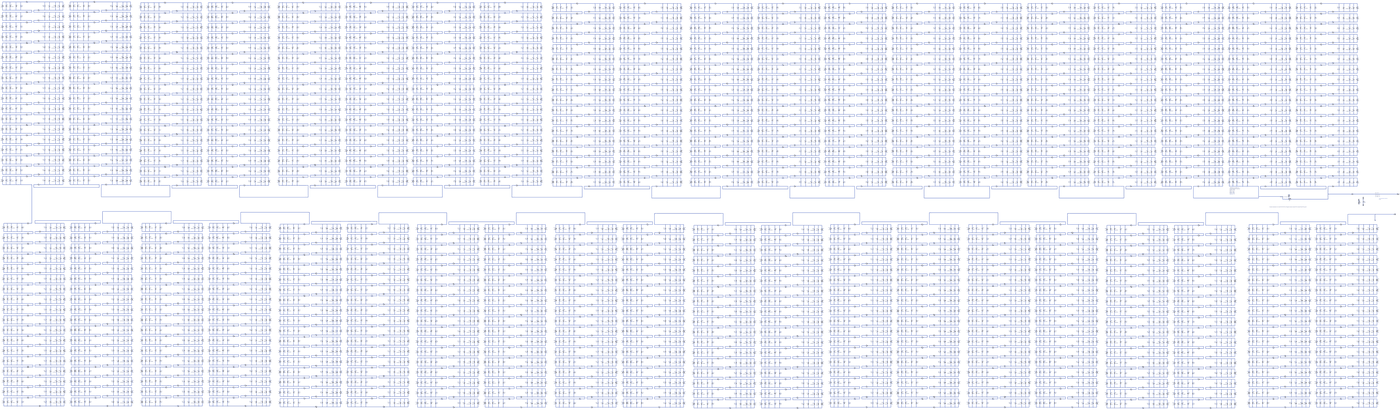
[diagram p0: schematic jac--m5sf-2--module-string--mosfet.asc, whole sheet]
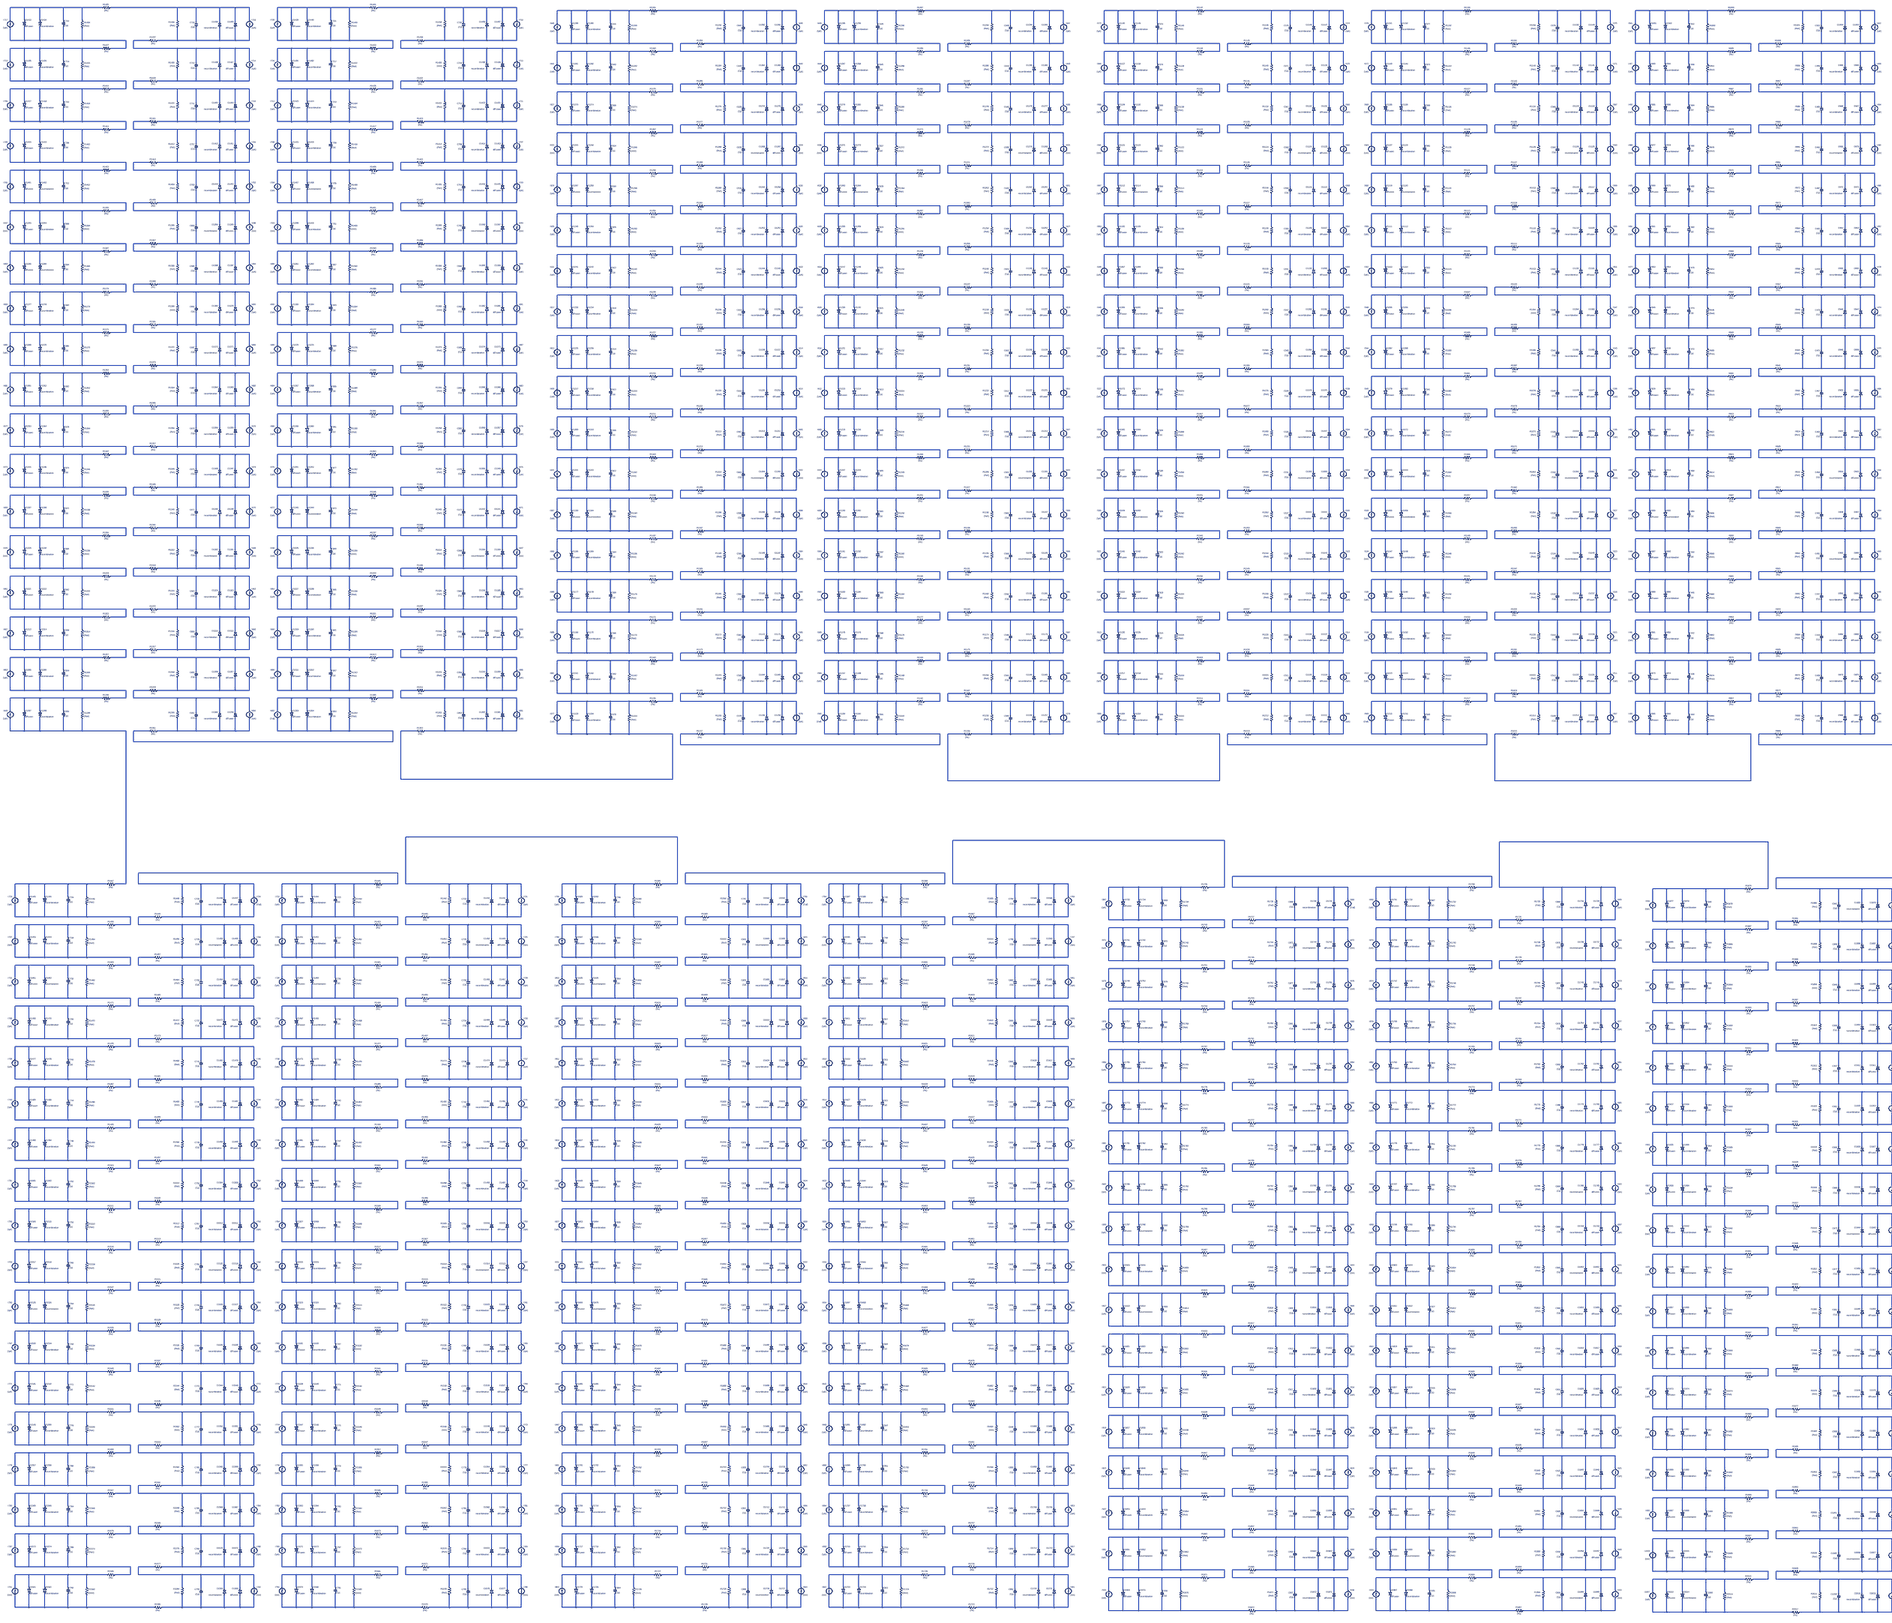
[diagram p1: schematic jac--m5sf-2--module-string--mosfet.asc, part, row 1 of 1, column 1 of 3]
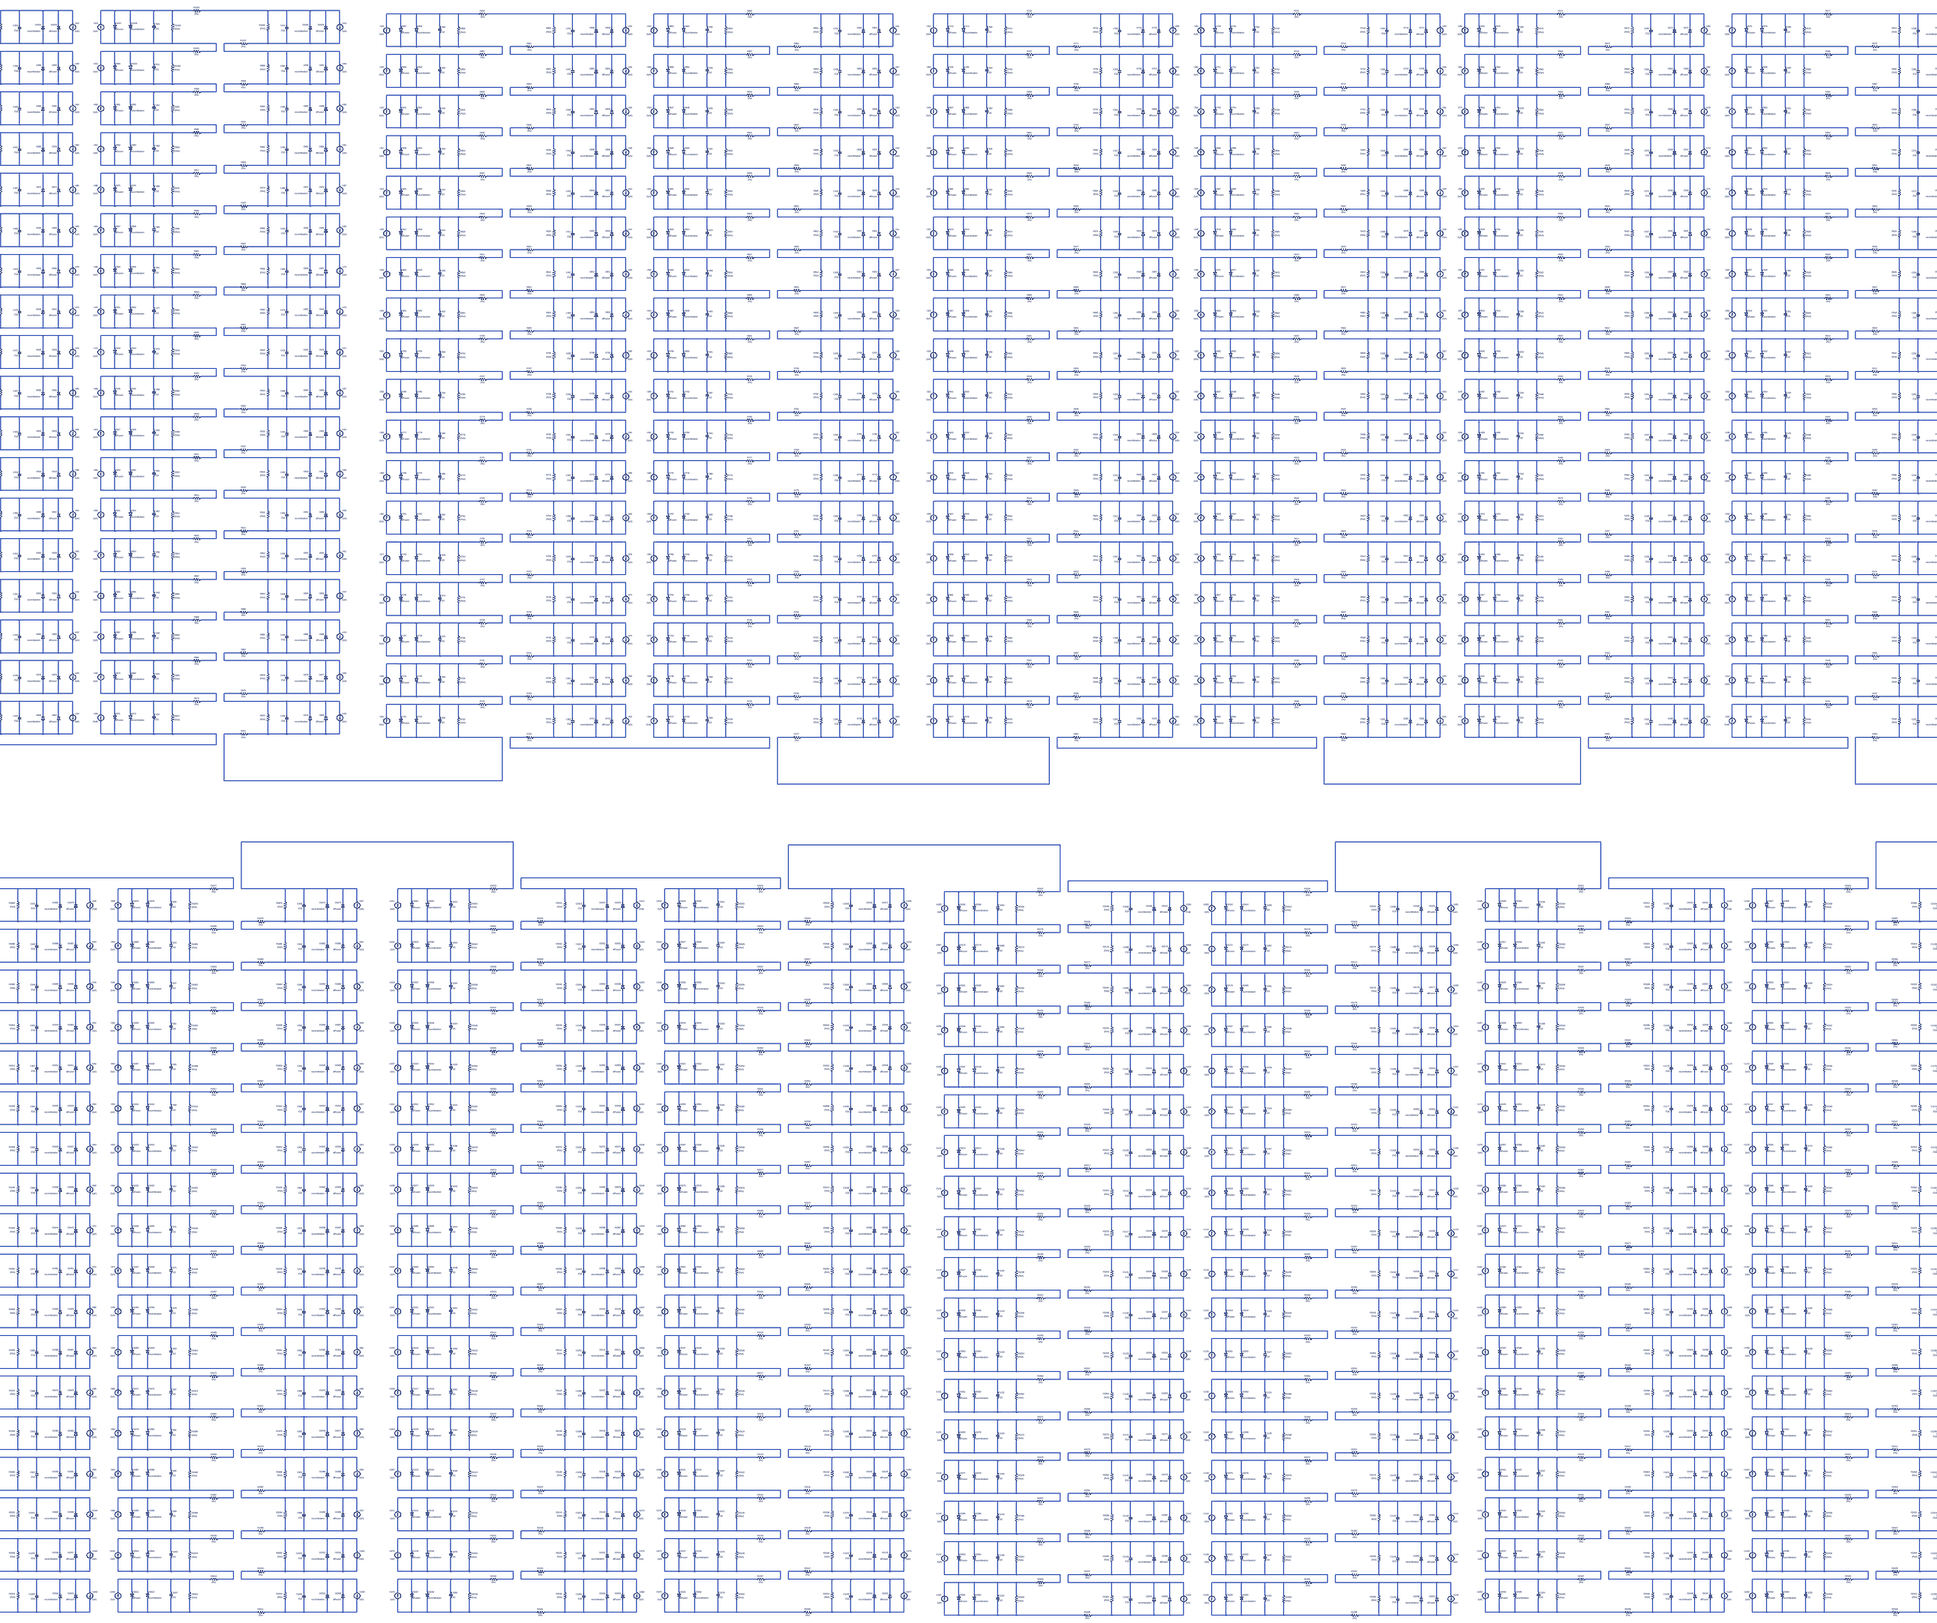
[diagram p2: schematic jac--m5sf-2--module-string--mosfet.asc, part, row 1 of 1, column 2 of 3]
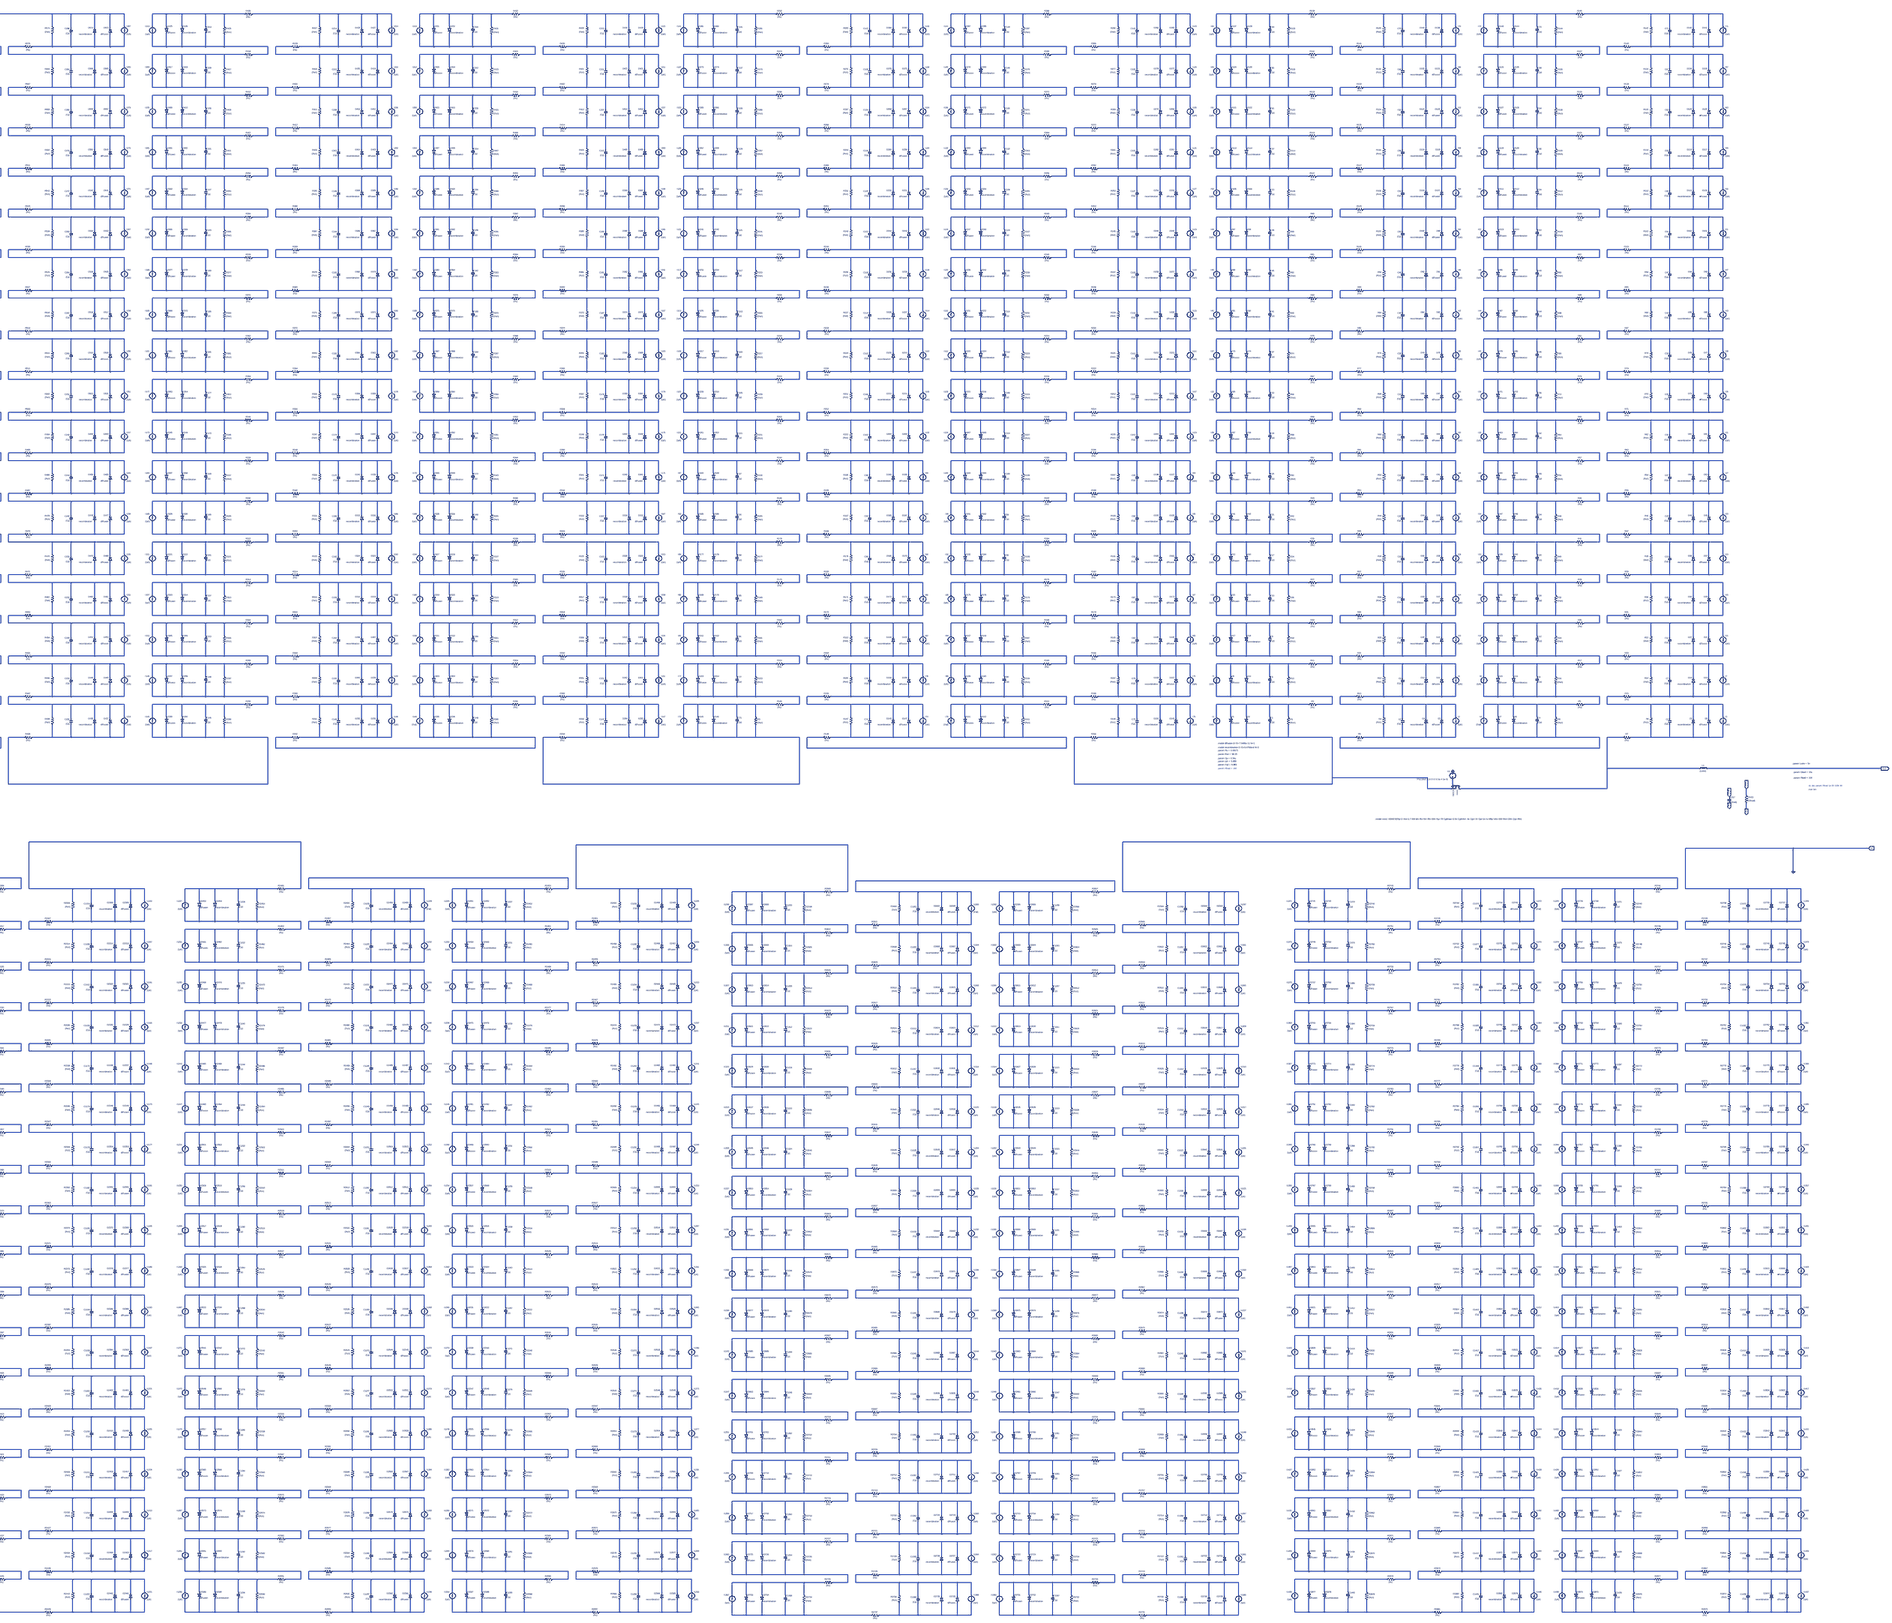
[diagram p3: schematic jac--m5sf-2--module-string--mosfet.asc, part, row 1 of 1, column 3 of 3]
* jac--m5sf-2--module-string--mosfet.asc
I1 N1436 N1399 {Iph}
D1 N1399 N1436 diffusion
D2 N1399 N1436 recombination
C1 N1399 N1436 {Cp}
R1 N1399 N1436 {Rsh}
R2 N1399 N1375 {Rs}
I2 N1376 N1439 {Iph}
D3 N1439 N1376 diffusion
D4 N1439 N1376 recombination
C2 N1439 N1376 {Cp}
R4 N1439 N1376 {Rsh}
R5 N1439 N1438 {Rs}
I3 N1379 N1441 {Iph}
D5 N1441 N1379 diffusion
D6 N1441 N1379 recombination
C3 N1441 N1379 {Cp}
R6 N1441 N1379 {Rsh}
R7 N1441 N1440 {Rs}
I4 N1438 N1400 {Ifail}
D7 N1400 N1438 diffusion
D8 N1400 N1438 recombination
C4 N1400 N1438 {Cp}
R8 N1400 N1438 {Rsh}
R9 N1400 N1378 {Rs}
I5 N1375 N1319 {Iph}
D9 N1319 N1375 diffusion
D10 N1319 N1375 recombination
C5 N1319 N1375 {Cp}
R10 N1319 N1375 {Rsh}
R11 N1319 N1295 {Rs}
I6 N1296 N1377 {Iph}
D11 N1377 N1296 diffusion
D12 N1377 N1296 recombination
C6 N1377 N1296 {Cp}
R12 N1377 N1296 {Rsh}
R13 N1377 N1376 {Rs}
I7 N1299 N1380 {Iph}
D13 N1380 N1299 diffusion
D14 N1380 N1299 recombination
C7 N1380 N1299 {Cp}
R14 N1380 N1299 {Rsh}
R15 N1380 N1379 {Rs}
I8 N1378 N1320 {Iph}
D15 N1320 N1378 diffusion
D16 N1320 N1378 recombination
C8 N1320 N1378 {Cp}
R16 N1320 N1378 {Rsh}
R17 N1320 N1298 {Rs}
I9 N1295 N1239 {Iph}
D17 N1239 N1295 diffusion
D18 N1239 N1295 recombination
C9 N1239 N1295 {Cp}
R18 N1239 N1295 {Rsh}
R19 N1239 N1215 {Rs}
I10 N1216 N1297 {Iph}
D19 N1297 N1216 diffusion
D20 N1297 N1216 recombination
C10 N1297 N1216 {Cp}
R20 N1297 N1216 {Rsh}
R21 N1297 N1296 {Rs}
I11 N1219 N1300 {Iph}
D21 N1300 N1219 diffusion
D22 N1300 N1219 recombination
C11 N1300 N1219 {Cp}
R22 N1300 N1219 {Rsh}
R23 N1300 N1299 {Rs}
I12 N1298 N1240 {Iph}
D23 N1240 N1298 diffusion
D24 N1240 N1298 recombination
C12 N1240 N1298 {Cp}
R24 N1240 N1298 {Rsh}
R25 N1240 N1218 {Rs}
I13 N1215 N1159 {Iph}
D25 N1159 N1215 diffusion
D26 N1159 N1215 recombination
C13 N1159 N1215 {Cp}
R26 N1159 N1215 {Rsh}
R27 N1159 N1135 {Rs}
I14 N1136 N1217 {Iph}
D27 N1217 N1136 diffusion
D28 N1217 N1136 recombination
C14 N1217 N1136 {Cp}
R28 N1217 N1136 {Rsh}
R29 N1217 N1216 {Rs}
I15 N1139 N1220 {Iph}
D29 N1220 N1139 diffusion
D30 N1220 N1139 recombination
C15 N1220 N1139 {Cp}
R30 N1220 N1139 {Rsh}
R31 N1220 N1219 {Rs}
I16 N1218 N1160 {Iph}
D31 N1160 N1218 diffusion
D32 N1160 N1218 recombination
C16 N1160 N1218 {Cp}
R32 N1160 N1218 {Rsh}
R33 N1160 N1138 {Rs}
I17 N1135 N1079 {Iph}
D33 N1079 N1135 diffusion
D34 N1079 N1135 recombination
C17 N1079 N1135 {Cp}
R34 N1079 N1135 {Rsh}
R35 N1079 N1055 {Rs}
I18 N1056 N1137 {Iph}
D35 N1137 N1056 diffusion
D36 N1137 N1056 recombination
C18 N1137 N1056 {Cp}
R36 N1137 N1056 {Rsh}
R37 N1137 N1136 {Rs}
I19 N1059 N1140 {Iph}
D37 N1140 N1059 diffusion
D38 N1140 N1059 recombination
C19 N1140 N1059 {Cp}
R38 N1140 N1059 {Rsh}
R39 N1140 N1139 {Rs}
I20 N1138 N1080 {Iph}
D39 N1080 N1138 diffusion
D40 N1080 N1138 recombination
C20 N1080 N1138 {Cp}
R40 N1080 N1138 {Rsh}
R41 N1080 N1058 {Rs}
I21 N1055 N999 {Iph}
D41 N999 N1055 diffusion
D42 N999 N1055 recombination
C21 N999 N1055 {Cp}
R42 N999 N1055 {Rsh}
R43 N999 N975 {Rs}
I22 N976 N1057 {Iph}
D43 N1057 N976 diffusion
D44 N1057 N976 recombination
C22 N1057 N976 {Cp}
R44 N1057 N976 {Rsh}
R45 N1057 N1056 {Rs}
I23 N979 N1060 {Iph}
D45 N1060 N979 diffusion
D46 N1060 N979 recombination
C23 N1060 N979 {Cp}
R46 N1060 N979 {Rsh}
R47 N1060 N1059 {Rs}
I24 N1058 N1000 {Iph}
D47 N1000 N1058 diffusion
D48 N1000 N1058 recombination
C24 N1000 N1058 {Cp}
R48 N1000 N1058 {Rsh}
R49 N1000 N978 {Rs}
I25 N975 N919 {Iph}
D49 N919 N975 diffusion
D50 N919 N975 recombination
C25 N919 N975 {Cp}
R50 N919 N975 {Rsh}
R51 N919 N895 {Rs}
I26 N896 N977 {Iph}
D51 N977 N896 diffusion
D52 N977 N896 recombination
C26 N977 N896 {Cp}
R52 N977 N896 {Rsh}
R53 N977 N976 {Rs}
I27 N899 N980 {Iph}
D53 N980 N899 diffusion
D54 N980 N899 recombination
C27 N980 N899 {Cp}
R54 N980 N899 {Rsh}
R55 N980 N979 {Rs}
I28 N978 N920 {Iph}
D55 N920 N978 diffusion
D56 N920 N978 recombination
C28 N920 N978 {Cp}
R56 N920 N978 {Rsh}
R57 N920 N898 {Rs}
I29 N895 N839 {Iph}
D57 N839 N895 diffusion
D58 N839 N895 recombination
C29 N839 N895 {Cp}
R58 N839 N895 {Rsh}
R59 N839 N815 {Rs}
I30 N816 N897 {Iph}
D59 N897 N816 diffusion
D60 N897 N816 recombination
C30 N897 N816 {Cp}
R60 N897 N816 {Rsh}
R61 N897 N896 {Rs}
I31 N819 N900 {Iph}
D61 N900 N819 diffusion
D62 N900 N819 recombination
C31 N900 N819 {Cp}
R62 N900 N819 {Rsh}
R63 N900 N899 {Rs}
I32 N898 N840 {Iph}
D63 N840 N898 diffusion
D64 N840 N898 recombination
C32 N840 N898 {Cp}
R64 N840 N898 {Rsh}
R65 N840 N818 {Rs}
I33 N815 N759 {Iph}
D65 N759 N815 diffusion
D66 N759 N815 recombination
C33 N759 N815 {Cp}
R66 N759 N815 {Rsh}
R67 N759 N735 {Rs}
I34 N736 N817 {Iph}
D67 N817 N736 diffusion
D68 N817 N736 recombination
C34 N817 N736 {Cp}
R68 N817 N736 {Rsh}
R69 N817 N816 {Rs}
I35 N739 N820 {Iph}
D69 N820 N739 diffusion
D70 N820 N739 recombination
C35 N820 N739 {Cp}
R70 N820 N739 {Rsh}
R71 N820 N819 {Rs}
I36 N818 N760 {Iph}
D71 N760 N818 diffusion
D72 N760 N818 recombination
C36 N760 N818 {Cp}
R72 N760 N818 {Rsh}
R73 N760 N738 {Rs}
I37 N735 N679 {Iph}
D73 N679 N735 diffusion
D74 N679 N735 recombination
C37 N679 N735 {Cp}
R74 N679 N735 {Rsh}
R75 N679 N655 {Rs}
I38 N656 N737 {Iph}
D75 N737 N656 diffusion
D76 N737 N656 recombination
C38 N737 N656 {Cp}
R76 N737 N656 {Rsh}
R77 N737 N736 {Rs}
I39 N659 N740 {Iph}
D77 N740 N659 diffusion
D78 N740 N659 recombination
C39 N740 N659 {Cp}
R78 N740 N659 {Rsh}
R79 N740 N739 {Rs}
I40 N738 N680 {Iph}
D79 N680 N738 diffusion
D80 N680 N738 recombination
C40 N680 N738 {Cp}
R80 N680 N738 {Rsh}
R81 N680 N658 {Rs}
I41 N655 N599 {Iph}
D81 N599 N655 diffusion
D82 N599 N655 recombination
C41 N599 N655 {Cp}
R82 N599 N655 {Rsh}
R83 N599 N575 {Rs}
I42 N576 N657 {Iph}
D83 N657 N576 diffusion
D84 N657 N576 recombination
C42 N657 N576 {Cp}
R84 N657 N576 {Rsh}
R85 N657 N656 {Rs}
I43 N579 N660 {Iph}
D85 N660 N579 diffusion
D86 N660 N579 recombination
C43 N660 N579 {Cp}
R86 N660 N579 {Rsh}
R87 N660 N659 {Rs}
I44 N658 N600 {Iph}
D87 N600 N658 diffusion
D88 N600 N658 recombination
C44 N600 N658 {Cp}
R88 N600 N658 {Rsh}
R89 N600 N578 {Rs}
I45 N575 N519 {Iph}
D89 N519 N575 diffusion
D90 N519 N575 recombination
C45 N519 N575 {Cp}
R90 N519 N575 {Rsh}
R91 N519 N495 {Rs}
I46 N496 N577 {Iph}
D91 N577 N496 diffusion
D92 N577 N496 recombination
C46 N577 N496 {Cp}
R92 N577 N496 {Rsh}
R93 N577 N576 {Rs}
I47 N499 N580 {Iph}
D93 N580 N499 diffusion
D94 N580 N499 recombination
C47 N580 N499 {Cp}
R94 N580 N499 {Rsh}
R95 N580 N579 {Rs}
I48 N578 N520 {Iph}
D95 N520 N578 diffusion
D96 N520 N578 recombination
C48 N520 N578 {Cp}
R96 N520 N578 {Rsh}
R97 N520 N498 {Rs}
I49 N495 N439 {Iph}
D97 N439 N495 diffusion
D98 N439 N495 recombination
C49 N439 N495 {Cp}
R98 N439 N495 {Rsh}
R99 N439 N415 {Rs}
I50 N416 N497 {Iph}
D99 N497 N416 diffusion
D100 N497 N416 recombination
C50 N497 N416 {Cp}
R100 N497 N416 {Rsh}
R101 N497 N496 {Rs}
I51 N419 N500 {Iph}
D101 N500 N419 diffusion
D102 N500 N419 recombination
C51 N500 N419 {Cp}
R102 N500 N419 {Rsh}
R103 N500 N499 {Rs}
I52 N498 N440 {Iph}
D103 N440 N498 diffusion
D104 N440 N498 recombination
C52 N440 N498 {Cp}
R104 N440 N498 {Rsh}
R105 N440 N418 {Rs}
I53 N415 N359 {Iph}
D105 N359 N415 diffusion
D106 N359 N415 recombination
C53 N359 N415 {Cp}
R106 N359 N415 {Rsh}
R107 N359 N335 {Rs}
I54 N336 N417 {Iph}
D107 N417 N336 diffusion
D108 N417 N336 recombination
C54 N417 N336 {Cp}
R108 N417 N336 {Rsh}
R109 N417 N416 {Rs}
I55 N339 N420 {Iph}
D109 N420 N339 diffusion
D110 N420 N339 recombination
C55 N420 N339 {Cp}
R110 N420 N339 {Rsh}
R111 N420 N419 {Rs}
I56 N418 N360 {Iph}
D111 N360 N418 diffusion
D112 N360 N418 recombination
C56 N360 N418 {Cp}
R112 N360 N418 {Rsh}
R113 N360 N338 {Rs}
I57 N335 N279 {Iph}
D113 N279 N335 diffusion
D114 N279 N335 recombination
C57 N279 N335 {Cp}
R114 N279 N335 {Rsh}
R115 N279 N255 {Rs}
I58 N256 N337 {Iph}
D115 N337 N256 diffusion
D116 N337 N256 recombination
C58 N337 N256 {Cp}
R116 N337 N256 {Rsh}
R117 N337 N336 {Rs}
I59 N259 N340 {Iph}
D117 N340 N259 diffusion
D118 N340 N259 recombination
C59 N340 N259 {Cp}
R118 N340 N259 {Rsh}
R119 N340 N339 {Rs}
I60 N338 N280 {Iph}
D119 N280 N338 diffusion
D120 N280 N338 recombination
C60 N280 N338 {Cp}
R120 N280 N338 {Rsh}
R121 N280 N258 {Rs}
I61 N255 N199 {Iph}
D121 N199 N255 diffusion
D122 N199 N255 recombination
C61 N199 N255 {Cp}
R122 N199 N255 {Rsh}
R123 N199 N175 {Rs}
I62 N176 N257 {Iph}
D123 N257 N176 diffusion
D124 N257 N176 recombination
C62 N257 N176 {Cp}
R124 N257 N176 {Rsh}
R125 N257 N256 {Rs}
I63 N179 N260 {Iph}
D125 N260 N179 diffusion
D126 N260 N179 recombination
C63 N260 N179 {Cp}
R126 N260 N179 {Rsh}
R127 N260 N259 {Rs}
I64 N258 N200 {Iph}
D127 N200 N258 diffusion
D128 N200 N258 recombination
C64 N200 N258 {Cp}
R128 N200 N258 {Rsh}
R129 N200 N178 {Rs}
I65 N175 N119 {Iph}
D129 N119 N175 diffusion
D130 N119 N175 recombination
C65 N119 N175 {Cp}
R130 N119 N175 {Rsh}
R131 N119 N095 {Rs}
I66 N096 N177 {Iph}
D131 N177 N096 diffusion
D132 N177 N096 recombination
C66 N177 N096 {Cp}
R132 N177 N096 {Rsh}
R133 N177 N176 {Rs}
I67 N099 N180 {Iph}
D133 N180 N099 diffusion
D134 N180 N099 recombination
C67 N180 N099 {Cp}
R134 N180 N099 {Rsh}
R135 N180 N179 {Rs}
I68 N178 N120 {Iph}
D135 N120 N178 diffusion
D136 N120 N178 recombination
C68 N120 N178 {Cp}
R136 N120 N178 {Rsh}
R137 N120 N098 {Rs}
I69 N095 N037 {Iph}
D137 N037 N095 diffusion
D138 N037 N095 recombination
C69 N037 N095 {Cp}
R138 N037 N095 {Rsh}
R139 N037 N038 {Rs}
I70 N038 N097 {Iph}
D139 N097 N038 diffusion
D140 N097 N038 recombination
C70 N097 N038 {Cp}
R140 N097 N038 {Rsh}
R141 N097 N096 {Rs}
I71 N040 N100 {Iph}
D141 N100 N040 diffusion
D142 N100 N040 recombination
C71 N100 N040 {Cp}
R142 N100 N040 {Rsh}
R143 N100 N099 {Rs}
I72 N098 N039 {Iph}
D143 N039 N098 diffusion
D144 N039 N098 recombination
C72 N039 N098 {Cp}
R144 N039 N098 {Rsh}
R145 N039 N040 {Rs}
I73 N1432 N1397 {Iph}
D145 N1397 N1432 diffusion
D146 N1397 N1432 recombination
C73 N1397 N1432 {Cp}
R3 N1397 N1432 {Rsh}
R146 N1397 N1369 {Rs}
I74 N1370 N1435 {Iph}
D147 N1435 N1370 diffusion
D148 N1435 N1370 recombination
C74 N1435 N1370 {Cp}
R147 N1435 N1370 {Rsh}
R148 N1435 N1434 {Rs}
I75 N1373 N1437 {Iph}
D149 N1437 N1373 diffusion
D150 N1437 N1373 recombination
C75 N1437 N1373 {Cp}
R149 N1437 N1373 {Rsh}
R150 N1437 N1436 {Rs}
I76 N1434 N1398 {Ifail}
D151 N1398 N1434 diffusion
D152 N1398 N1434 recombination
C76 N1398 N1434 {Cp}
R151 N1398 N1434 {Rsh}
R152 N1398 N1372 {Rs}
I77 N1369 N1317 {Iph}
D153 N1317 N1369 diffusion
D154 N1317 N1369 recombination
C77 N1317 N1369 {Cp}
R153 N1317 N1369 {Rsh}
R154 N1317 N1289 {Rs}
I78 N1290 N1371 {Iph}
D155 N1371 N1290 diffusion
D156 N1371 N1290 recombination
C78 N1371 N1290 {Cp}
R155 N1371 N1290 {Rsh}
R156 N1371 N1370 {Rs}
I79 N1293 N1374 {Iph}
D157 N1374 N1293 diffusion
D158 N1374 N1293 recombination
C79 N1374 N1293 {Cp}
R157 N1374 N1293 {Rsh}
R158 N1374 N1373 {Rs}
I80 N1372 N1318 {Iph}
D159 N1318 N1372 diffusion
D160 N1318 N1372 recombination
C80 N1318 N1372 {Cp}
R159 N1318 N1372 {Rsh}
R160 N1318 N1292 {Rs}
I81 N1289 N1237 {Iph}
D161 N1237 N1289 diffusion
D162 N1237 N1289 recombination
C81 N1237 N1289 {Cp}
R161 N1237 N1289 {Rsh}
R162 N1237 N1209 {Rs}
I82 N1210 N1291 {Iph}
D163 N1291 N1210 diffusion
D164 N1291 N1210 recombination
C82 N1291 N1210 {Cp}
R163 N1291 N1210 {Rsh}
R164 N1291 N1290 {Rs}
I83 N1213 N1294 {Iph}
D165 N1294 N1213 diffusion
D166 N1294 N1213 recombination
C83 N1294 N1213 {Cp}
R165 N1294 N1213 {Rsh}
R166 N1294 N1293 {Rs}
I84 N1292 N1238 {Iph}
D167 N1238 N1292 diffusion
D168 N1238 N1292 recombination
C84 N1238 N1292 {Cp}
R167 N1238 N1292 {Rsh}
R168 N1238 N1212 {Rs}
I85 N1209 N1157 {Iph}
D169 N1157 N1209 diffusion
D170 N1157 N1209 recombination
C85 N1157 N1209 {Cp}
R169 N1157 N1209 {Rsh}
R170 N1157 N1129 {Rs}
I86 N1130 N1211 {Iph}
D171 N1211 N1130 diffusion
D172 N1211 N1130 recombination
C86 N1211 N1130 {Cp}
R171 N1211 N1130 {Rsh}
R172 N1211 N1210 {Rs}
I87 N1133 N1214 {Iph}
D173 N1214 N1133 diffusion
D174 N1214 N1133 recombination
C87 N1214 N1133 {Cp}
R173 N1214 N1133 {Rsh}
R174 N1214 N1213 {Rs}
I88 N1212 N1158 {Iph}
D175 N1158 N1212 diffusion
D176 N1158 N1212 recombination
C88 N1158 N1212 {Cp}
R175 N1158 N1212 {Rsh}
R176 N1158 N1132 {Rs}
I89 N1129 N1077 {Iph}
D177 N1077 N1129 diffusion
D178 N1077 N1129 recombination
C89 N1077 N1129 {Cp}
R177 N1077 N1129 {Rsh}
R178 N1077 N1049 {Rs}
I90 N1050 N1131 {Iph}
D179 N1131 N1050 diffusion
D180 N1131 N1050 recombination
C90 N1131 N1050 {Cp}
R179 N1131 N1050 {Rsh}
R180 N1131 N1130 {Rs}
I91 N1053 N1134 {Iph}
D181 N1134 N1053 diffusion
D182 N1134 N1053 recombination
C91 N1134 N1053 {Cp}
R181 N1134 N1053 {Rsh}
R182 N1134 N1133 {Rs}
I92 N1132 N1078 {Iph}
D183 N1078 N1132 diffusion
D184 N1078 N1132 recombination
C92 N1078 N1132 {Cp}
R183 N1078 N1132 {Rsh}
R184 N1078 N1052 {Rs}
I93 N1049 N997 {Iph}
D185 N997 N1049 diffusion
D186 N997 N1049 recombination
C93 N997 N1049 {Cp}
R185 N997 N1049 {Rsh}
R186 N997 N969 {Rs}
I94 N970 N1051 {Iph}
D187 N1051 N970 diffusion
D188 N1051 N970 recombination
C94 N1051 N970 {Cp}
R187 N1051 N970 {Rsh}
R188 N1051 N1050 {Rs}
I95 N973 N1054 {Iph}
D189 N1054 N973 diffusion
D190 N1054 N973 recombination
C95 N1054 N973 {Cp}
R189 N1054 N973 {Rsh}
R190 N1054 N1053 {Rs}
I96 N1052 N998 {Iph}
D191 N998 N1052 diffusion
D192 N998 N1052 recombination
C96 N998 N1052 {Cp}
R191 N998 N1052 {Rsh}
R192 N998 N972 {Rs}
I97 N969 N917 {Iph}
D193 N917 N969 diffusion
D194 N917 N969 recombination
C97 N917 N969 {Cp}
R193 N917 N969 {Rsh}
R194 N917 N889 {Rs}
I98 N890 N971 {Iph}
D195 N971 N890 diffusion
D196 N971 N890 recombination
C98 N971 N890 {Cp}
R195 N971 N890 {Rsh}
R196 N971 N970 {Rs}
I99 N893 N974 {Iph}
D197 N974 N893 diffusion
D198 N974 N893 recombination
C99 N974 N893 {Cp}
R197 N974 N893 {Rsh}
R198 N974 N973 {Rs}
I100 N972 N918 {Iph}
D199 N918 N972 diffusion
D200 N918 N972 recombination
C100 N918 N972 {Cp}
R199 N918 N972 {Rsh}
R200 N918 N892 {Rs}
I101 N889 N837 {Iph}
D201 N837 N889 diffusion
D202 N837 N889 recombination
C101 N837 N889 {Cp}
R201 N837 N889 {Rsh}
R202 N837 N809 {Rs}
I102 N810 N891 {Iph}
D203 N891 N810 diffusion
D204 N891 N810 recombination
C102 N891 N810 {Cp}
R203 N891 N810 {Rsh}
R204 N891 N890 {Rs}
I103 N813 N894 {Iph}
D205 N894 N813 diffusion
D206 N894 N813 recombination
C103 N894 N813 {Cp}
R205 N894 N813 {Rsh}
R206 N894 N893 {Rs}
I104 N892 N838 {Iph}
D207 N838 N892 diffusion
D208 N838 N892 recombination
C104 N838 N892 {Cp}
R207 N838 N892 {Rsh}
R208 N838 N812 {Rs}
I105 N809 N757 {Iph}
D209 N757 N809 diffusion
D210 N757 N809 recombination
C105 N757 N809 {Cp}
R209 N757 N809 {Rsh}
R210 N757 N729 {Rs}
I106 N730 N811 {Iph}
D211 N811 N730 diffusion
D212 N811 N730 recombination
C106 N811 N730 {Cp}
R211 N811 N730 {Rsh}
R212 N811 N810 {Rs}
I107 N733 N814 {Iph}
D213 N814 N733 diffusion
D214 N814 N733 recombination
C107 N814 N733 {Cp}
R213 N814 N733 {Rsh}
R214 N814 N813 {Rs}
I108 N812 N758 {Iph}
D215 N758 N812 diffusion
D216 N758 N812 recombination
C108 N758 N812 {Cp}
R215 N758 N812 {Rsh}
R216 N758 N732 {Rs}
I109 N729 N677 {Iph}
D217 N677 N729 diffusion
D218 N677 N729 recombination
C109 N677 N729 {Cp}
R217 N677 N729 {Rsh}
R218 N677 N649 {Rs}
I110 N650 N731 {Iph}
D219 N731 N650 diffusion
D220 N731 N650 recombination
C110 N731 N650 {Cp}
R219 N731 N650 {Rsh}
R220 N731 N730 {Rs}
I111 N653 N734 {Iph}
D221 N734 N653 diffusion
D222 N734 N653 recombination
C111 N734 N653 {Cp}
R221 N734 N653 {Rsh}
R222 N734 N733 {Rs}
I112 N732 N678 {Iph}
D223 N678 N732 diffusion
D224 N678 N732 recombination
C112 N678 N732 {Cp}
R223 N678 N732 {Rsh}
R224 N678 N652 {Rs}
I113 N649 N597 {Iph}
D225 N597 N649 diffusion
D226 N597 N649 recombination
C113 N597 N649 {Cp}
R225 N597 N649 {Rsh}
R226 N597 N569 {Rs}
I114 N570 N651 {Iph}
D227 N651 N570 diffusion
D228 N651 N570 recombination
C114 N651 N570 {Cp}
R227 N651 N570 {Rsh}
R228 N651 N650 {Rs}
I115 N573 N654 {Iph}
D229 N654 N573 diffusion
D230 N654 N573 recombination
C115 N654 N573 {Cp}
R229 N654 N573 {Rsh}
R230 N654 N653 {Rs}
I116 N652 N598 {Iph}
D231 N598 N652 diffusion
D232 N598 N652 recombination
C116 N598 N652 {Cp}
R231 N598 N652 {Rsh}
R232 N598 N572 {Rs}
I117 N569 N517 {Iph}
D233 N517 N569 diffusion
D234 N517 N569 recombination
C117 N517 N569 {Cp}
R233 N517 N569 {Rsh}
R234 N517 N489 {Rs}
I118 N490 N571 {Iph}
D235 N571 N490 diffusion
D236 N571 N490 recombination
C118 N571 N490 {Cp}
R235 N571 N490 {Rsh}
R236 N571 N570 {Rs}
I119 N493 N574 {Iph}
D237 N574 N493 diffusion
D238 N574 N493 recombination
C119 N574 N493 {Cp}
R237 N574 N493 {Rsh}
R238 N574 N573 {Rs}
I120 N572 N518 {Iph}
D239 N518 N572 diffusion
D240 N518 N572 recombination
C120 N518 N572 {Cp}
R239 N518 N572 {Rsh}
R240 N518 N492 {Rs}
I121 N489 N437 {Iph}
D241 N437 N489 diffusion
D242 N437 N489 recombination
C121 N437 N489 {Cp}
R241 N437 N489 {Rsh}
R242 N437 N409 {Rs}
I122 N410 N491 {Iph}
D243 N491 N410 diffusion
D244 N491 N410 recombination
C122 N491 N410 {Cp}
R243 N491 N410 {Rsh}
R244 N491 N490 {Rs}
I123 N413 N494 {Iph}
D245 N494 N413 diffusion
D246 N494 N413 recombination
C123 N494 N413 {Cp}
R245 N494 N413 {Rsh}
R246 N494 N493 {Rs}
I124 N492 N438 {Iph}
D247 N438 N492 diffusion
D248 N438 N492 recombination
C124 N438 N492 {Cp}
R247 N438 N492 {Rsh}
R248 N438 N412 {Rs}
I125 N409 N357 {Iph}
D249 N357 N409 diffusion
D250 N357 N409 recombination
C125 N357 N409 {Cp}
R249 N357 N409 {Rsh}
R250 N357 N329 {Rs}
I126 N330 N411 {Iph}
D251 N411 N330 diffusion
D252 N411 N330 recombination
C126 N411 N330 {Cp}
R251 N411 N330 {Rsh}
R252 N411 N410 {Rs}
I127 N333 N414 {Iph}
D253 N414 N333 diffusion
D254 N414 N333 recombination
C127 N414 N333 {Cp}
R253 N414 N333 {Rsh}
R254 N414 N413 {Rs}
I128 N412 N358 {Iph}
D255 N358 N412 diffusion
D256 N358 N412 recombination
C128 N358 N412 {Cp}
R255 N358 N412 {Rsh}
R256 N358 N332 {Rs}
I129 N329 N277 {Iph}
D257 N277 N329 diffusion
D258 N277 N329 recombination
C129 N277 N329 {Cp}
R257 N277 N329 {Rsh}
R258 N277 N249 {Rs}
I130 N250 N331 {Iph}
D259 N331 N250 diffusion
D260 N331 N250 recombination
C130 N331 N250 {Cp}
R259 N331 N250 {Rsh}
R260 N331 N330 {Rs}
I131 N253 N334 {Iph}
D261 N334 N253 diffusion
D262 N334 N253 recombination
C131 N334 N253 {Cp}
R261 N334 N253 {Rsh}
R262 N334 N333 {Rs}
I132 N332 N278 {Iph}
D263 N278 N332 diffusion
D264 N278 N332 recombination
C132 N278 N332 {Cp}
R263 N278 N332 {Rsh}
R264 N278 N252 {Rs}
I133 N249 N197 {Iph}
D265 N197 N249 diffusion
D266 N197 N249 recombination
C133 N197 N249 {Cp}
R265 N197 N249 {Rsh}
R266 N197 N169 {Rs}
I134 N170 N251 {Iph}
D267 N251 N170 diffusion
D268 N251 N170 recombination
C134 N251 N170 {Cp}
R267 N251 N170 {Rsh}
R268 N251 N250 {Rs}
I135 N173 N254 {Iph}
D269 N254 N173 diffusion
D270 N254 N173 recombination
C135 N254 N173 {Cp}
R269 N254 N173 {Rsh}
R270 N254 N253 {Rs}
I136 N252 N198 {Iph}
D271 N198 N252 diffusion
D272 N198 N252 recombination
C136 N198 N252 {Cp}
R271 N198 N252 {Rsh}
R272 N198 N172 {Rs}
I137 N169 N117 {Iph}
D273 N117 N169 diffusion
D274 N117 N169 recombination
C137 N117 N169 {Cp}
R273 N117 N169 {Rsh}
R274 N117 N089 {Rs}
I138 N090 N171 {Iph}
D275 N171 N090 diffusion
D276 N171 N090 recombination
C138 N171 N090 {Cp}
R275 N171 N090 {Rsh}
R276 N171 N170 {Rs}
I139 N093 N174 {Iph}
D277 N174 N093 diffusion
D278 N174 N093 recombination
C139 N174 N093 {Cp}
R277 N174 N093 {Rsh}
R278 N174 N173 {Rs}
I140 N172 N118 {Iph}
D279 N118 N172 diffusion
D280 N118 N172 recombination
C140 N118 N172 {Cp}
R279 N118 N172 {Rsh}
R280 N118 N092 {Rs}
I141 N089 N033 {Iph}
D281 N033 N089 diffusion
D282 N033 N089 recombination
C141 N033 N089 {Cp}
R281 N033 N089 {Rsh}
R282 N033 N034 {Rs}
I142 N034 N091 {Iph}
D283 N091 N034 diffusion
D284 N091 N034 recombination
C142 N091 N034 {Cp}
R283 N091 N034 {Rsh}
R284 N091 N090 {Rs}
I143 N036 N094 {Iph}
D285 N094 N036 diffusion
D286 N094 N036 recombination
C143 N094 N036 {Cp}
R285 N094 N036 {Rsh}
R286 N094 N093 {Rs}
I144 N092 N035 {Iph}
D287 N035 N092 diffusion
D288 N035 N092 recombination
C144 N035 N092 {Cp}
R287 N035 N092 {Rsh}
R288 N035 N036 {Rs}
I145 N1428 N1395 {Iph}
D289 N1395 N1428 diffusion
D290 N1395 N1428 recombination
C145 N1395 N1428 {Cp}
R289 N1395 N1428 {Rsh}
R290 N1395 N1363 {Rs}
I146 N1364 N1431 {Iph}
D291 N1431 N1364 diffusion
D292 N1431 N1364 recombination
C146 N1431 N1364 {Cp}
R291 N1431 N1364 {Rsh}
R292 N1431 N1430 {Rs}
I147 N1367 N1433 {Iph}
D293 N1433 N1367 diffusion
D294 N1433 N1367 recombination
C147 N1433 N1367 {Cp}
R293 N1433 N1367 {Rsh}
R294 N1433 N1432 {Rs}
I148 N1430 N1396 {Ifail}
D295 N1396 N1430 diffusion
D296 N1396 N1430 recombination
C148 N1396 N1430 {Cp}
R295 N1396 N1430 {Rsh}
R296 N1396 N1366 {Rs}
I149 N1363 N1315 {Iph}
D297 N1315 N1363 diffusion
D298 N1315 N1363 recombination
C149 N1315 N1363 {Cp}
R297 N1315 N1363 {Rsh}
R298 N1315 N1283 {Rs}
I150 N1284 N1365 {Iph}
D299 N1365 N1284 diffusion
D300 N1365 N1284 recombination
C150 N1365 N1284 {Cp}
R299 N1365 N1284 {Rsh}
R300 N1365 N1364 {Rs}
I151 N1287 N1368 {Iph}
D301 N1368 N1287 diffusion
D302 N1368 N1287 recombination
C151 N1368 N1287 {Cp}
R301 N1368 N1287 {Rsh}
R302 N1368 N1367 {Rs}
I152 N1366 N1316 {Iph}
D303 N1316 N1366 diffusion
D304 N1316 N1366 recombination
C152 N1316 N1366 {Cp}
R303 N1316 N1366 {Rsh}
R304 N1316 N1286 {Rs}
I153 N1283 N1235 {Iph}
D305 N1235 N1283 diffusion
D306 N1235 N1283 recombination
C153 N1235 N1283 {Cp}
R305 N1235 N1283 {Rsh}
R306 N1235 N1203 {Rs}
I154 N1204 N1285 {Iph}
D307 N1285 N1204 diffusion
D308 N1285 N1204 recombination
C154 N1285 N1204 {Cp}
R307 N1285 N1204 {Rsh}
R308 N1285 N1284 {Rs}
I155 N1207 N1288 {Iph}
D309 N1288 N1207 diffusion
D310 N1288 N1207 recombination
C155 N1288 N1207 {Cp}
R309 N1288 N1207 {Rsh}
R310 N1288 N1287 {Rs}
I156 N1286 N1236 {Iph}
D311 N1236 N1286 diffusion
D312 N1236 N1286 recombination
C156 N1236 N1286 {Cp}
R311 N1236 N1286 {Rsh}
R312 N1236 N1206 {Rs}
I157 N1203 N1155 {Iph}
D313 N1155 N1203 diffusion
D314 N1155 N1203 recombination
C157 N1155 N1203 {Cp}
R313 N1155 N1203 {Rsh}
R314 N1155 N1123 {Rs}
I158 N1124 N1205 {Iph}
D315 N1205 N1124 diffusion
D316 N1205 N1124 recombination
C158 N1205 N1124 {Cp}
R315 N1205 N1124 {Rsh}
R316 N1205 N1204 {Rs}
I159 N1127 N1208 {Iph}
D317 N1208 N1127 diffusion
D318 N1208 N1127 recombination
C159 N1208 N1127 {Cp}
R317 N1208 N1127 {Rsh}
R318 N1208 N1207 {Rs}
I160 N1206 N1156 {Iph}
D319 N1156 N1206 diffusion
D320 N1156 N1206 recombination
C160 N1156 N1206 {Cp}
R319 N1156 N1206 {Rsh}
R320 N1156 N1126 {Rs}
I161 N1123 N1075 {Iph}
D321 N1075 N1123 diffusion
D322 N1075 N1123 recombination
C161 N1075 N1123 {Cp}
R321 N1075 N1123 {Rsh}
R322 N1075 N1043 {Rs}
I162 N1044 N1125 {Iph}
D323 N1125 N1044 diffusion
D324 N1125 N1044 recombination
C162 N1125 N1044 {Cp}
R323 N1125 N1044 {Rsh}
R324 N1125 N1124 {Rs}
I163 N1047 N1128 {Iph}
D325 N1128 N1047 diffusion
D326 N1128 N1047 recombination
C163 N1128 N1047 {Cp}
R325 N1128 N1047 {Rsh}
R326 N1128 N1127 {Rs}
I164 N1126 N1076 {Iph}
D327 N1076 N1126 diffusion
D328 N1076 N1126 recombination
C164 N1076 N1126 {Cp}
R327 N1076 N1126 {Rsh}
R328 N1076 N1046 {Rs}
I165 N1043 N995 {Iph}
D329 N995 N1043 diffusion
D330 N995 N1043 recombination
C165 N995 N1043 {Cp}
R329 N995 N1043 {Rsh}
R330 N995 N963 {Rs}
I166 N964 N1045 {Iph}
D331 N1045 N964 diffusion
D332 N1045 N964 recombination
C166 N1045 N964 {Cp}
R331 N1045 N964 {Rsh}
R332 N1045 N1044 {Rs}
I167 N967 N1048 {Iph}
D333 N1048 N967 diffusion
D334 N1048 N967 recombination
C167 N1048 N967 {Cp}
R333 N1048 N967 {Rsh}
R334 N1048 N1047 {Rs}
I168 N1046 N996 {Iph}
D335 N996 N1046 diffusion
D336 N996 N1046 recombination
C168 N996 N1046 {Cp}
R335 N996 N1046 {Rsh}
R336 N996 N966 {Rs}
I169 N963 N915 {Iph}
D337 N915 N963 diffusion
D338 N915 N963 recombination
C169 N915 N963 {Cp}
R337 N915 N963 {Rsh}
R338 N915 N883 {Rs}
I170 N884 N965 {Iph}
D339 N965 N884 diffusion
D340 N965 N884 recombination
C170 N965 N884 {Cp}
R339 N965 N884 {Rsh}
R340 N965 N964 {Rs}
I171 N887 N968 {Iph}
D341 N968 N887 diffusion
D342 N968 N887 recombination
C171 N968 N887 {Cp}
R341 N968 N887 {Rsh}
R342 N968 N967 {Rs}
I172 N966 N916 {Iph}
D343 N916 N966 diffusion
D344 N916 N966 recombination
C172 N916 N966 {Cp}
R343 N916 N966 {Rsh}
R344 N916 N886 {Rs}
I173 N883 N835 {Iph}
D345 N835 N883 diffusion
D346 N835 N883 recombination
C173 N835 N883 {Cp}
R345 N835 N883 {Rsh}
R346 N835 N803 {Rs}
I174 N804 N885 {Iph}
D347 N885 N804 diffusion
D348 N885 N804 recombination
C174 N885 N804 {Cp}
R347 N885 N804 {Rsh}
R348 N885 N884 {Rs}
I175 N807 N888 {Iph}
D349 N888 N807 diffusion
D350 N888 N807 recombination
C175 N888 N807 {Cp}
R349 N888 N807 {Rsh}
R350 N888 N887 {Rs}
I176 N886 N836 {Iph}
D351 N836 N886 diffusion
D352 N836 N886 recombination
C176 N836 N886 {Cp}
R351 N836 N886 {Rsh}
R352 N836 N806 {Rs}
I177 N803 N755 {Iph}
D353 N755 N803 diffusion
D354 N755 N803 recombination
C177 N755 N803 {Cp}
R353 N755 N803 {Rsh}
R354 N755 N723 {Rs}
I178 N724 N805 {Iph}
D355 N805 N724 diffusion
D356 N805 N724 recombination
C178 N805 N724 {Cp}
R355 N805 N724 {Rsh}
R356 N805 N804 {Rs}
I179 N727 N808 {Iph}
D357 N808 N727 diffusion
D358 N808 N727 recombination
C179 N808 N727 {Cp}
R357 N808 N727 {Rsh}
R358 N808 N807 {Rs}
I180 N806 N756 {Iph}
D359 N756 N806 diffusion
D360 N756 N806 recombination
C180 N756 N806 {Cp}
R359 N756 N806 {Rsh}
R360 N756 N726 {Rs}
I181 N723 N675 {Iph}
D361 N675 N723 diffusion
D362 N675 N723 recombination
C181 N675 N723 {Cp}
R361 N675 N723 {Rsh}
R362 N675 N643 {Rs}
I182 N644 N725 {Iph}
D363 N725 N644 diffusion
D364 N725 N644 recombination
C182 N725 N644 {Cp}
R363 N725 N644 {Rsh}
R364 N725 N724 {Rs}
I183 N647 N728 {Iph}
D365 N728 N647 diffusion
D366 N728 N647 recombination
C183 N728 N647 {Cp}
R365 N728 N647 {Rsh}
R366 N728 N727 {Rs}
I184 N726 N676 {Iph}
D367 N676 N726 diffusion
D368 N676 N726 recombination
C184 N676 N726 {Cp}
R367 N676 N726 {Rsh}
R368 N676 N646 {Rs}
I185 N643 N595 {Iph}
D369 N595 N643 diffusion
D370 N595 N643 recombination
C185 N595 N643 {Cp}
R369 N595 N643 {Rsh}
R370 N595 N563 {Rs}
I186 N564 N645 {Iph}
D371 N645 N564 diffusion
D372 N645 N564 recombination
C186 N645 N564 {Cp}
R371 N645 N564 {Rsh}
R372 N645 N644 {Rs}
I187 N567 N648 {Iph}
D373 N648 N567 diffusion
D374 N648 N567 recombination
C187 N648 N567 {Cp}
R373 N648 N567 {Rsh}
R374 N648 N647 {Rs}
I188 N646 N596 {Iph}
D375 N596 N646 diffusion
D376 N596 N646 recombination
C188 N596 N646 {Cp}
R375 N596 N646 {Rsh}
R376 N596 N566 {Rs}
I189 N563 N515 {Iph}
D377 N515 N563 diffusion
D378 N515 N563 recombination
C189 N515 N563 {Cp}
R377 N515 N563 {Rsh}
R378 N515 N483 {Rs}
I190 N484 N565 {Iph}
D379 N565 N484 diffusion
D380 N565 N484 recombination
C190 N565 N484 {Cp}
R379 N565 N484 {Rsh}
R380 N565 N564 {Rs}
I191 N487 N568 {Iph}
D381 N568 N487 diffusion
D382 N568 N487 recombination
C191 N568 N487 {Cp}
R381 N568 N487 {Rsh}
R382 N568 N567 {Rs}
I192 N566 N516 {Iph}
D383 N516 N566 diffusion
D384 N516 N566 recombination
C192 N516 N566 {Cp}
R383 N516 N566 {Rsh}
R384 N516 N486 {Rs}
I193 N483 N435 {Iph}
D385 N435 N483 diffusion
D386 N435 N483 recombination
C193 N435 N483 {Cp}
R385 N435 N483 {Rsh}
R386 N435 N403 {Rs}
I194 N404 N485 {Iph}
D387 N485 N404 diffusion
D388 N485 N404 recombination
C194 N485 N404 {Cp}
R387 N485 N404 {Rsh}
R388 N485 N484 {Rs}
I195 N407 N488 {Iph}
D389 N488 N407 diffusion
D390 N488 N407 recombination
C195 N488 N407 {Cp}
R389 N488 N407 {Rsh}
R390 N488 N487 {Rs}
I196 N486 N436 {Iph}
D391 N436 N486 diffusion
D392 N436 N486 recombination
C196 N436 N486 {Cp}
R391 N436 N486 {Rsh}
R392 N436 N406 {Rs}
I197 N403 N355 {Iph}
D393 N355 N403 diffusion
D394 N355 N403 recombination
C197 N355 N403 {Cp}
R393 N355 N403 {Rsh}
R394 N355 N323 {Rs}
I198 N324 N405 {Iph}
D395 N405 N324 diffusion
D396 N405 N324 recombination
C198 N405 N324 {Cp}
R395 N405 N324 {Rsh}
R396 N405 N404 {Rs}
I199 N327 N408 {Iph}
D397 N408 N327 diffusion
D398 N408 N327 recombination
C199 N408 N327 {Cp}
R397 N408 N327 {Rsh}
R398 N408 N407 {Rs}
I200 N406 N356 {Iph}
D399 N356 N406 diffusion
D400 N356 N406 recombination
C200 N356 N406 {Cp}
R399 N356 N406 {Rsh}
R400 N356 N326 {Rs}
I201 N323 N275 {Iph}
D401 N275 N323 diffusion
D402 N275 N323 recombination
C201 N275 N323 {Cp}
R401 N275 N323 {Rsh}
R402 N275 N243 {Rs}
I202 N244 N325 {Iph}
D403 N325 N244 diffusion
D404 N325 N244 recombination
C202 N325 N244 {Cp}
R403 N325 N244 {Rsh}
R404 N325 N324 {Rs}
I203 N247 N328 {Iph}
D405 N328 N247 diffusion
D406 N328 N247 recombination
C203 N328 N247 {Cp}
R405 N328 N247 {Rsh}
R406 N328 N327 {Rs}
I204 N326 N276 {Iph}
D407 N276 N326 diffusion
D408 N276 N326 recombination
C204 N276 N326 {Cp}
R407 N276 N326 {Rsh}
R408 N276 N246 {Rs}
I205 N243 N195 {Iph}
D409 N195 N243 diffusion
D410 N195 N243 recombination
C205 N195 N243 {Cp}
R409 N195 N243 {Rsh}
R410 N195 N163 {Rs}
I206 N164 N245 {Iph}
D411 N245 N164 diffusion
D412 N245 N164 recombination
C206 N245 N164 {Cp}
R411 N245 N164 {Rsh}
R412 N245 N244 {Rs}
I207 N167 N248 {Iph}
D413 N248 N167 diffusion
D414 N248 N167 recombination
C207 N248 N167 {Cp}
R413 N248 N167 {Rsh}
R414 N248 N247 {Rs}
I208 N246 N196 {Iph}
D415 N196 N246 diffusion
D416 N196 N246 recombination
C208 N196 N246 {Cp}
R415 N196 N246 {Rsh}
R416 N196 N166 {Rs}
I209 N163 N115 {Iph}
D417 N115 N163 diffusion
D418 N115 N163 recombination
C209 N115 N163 {Cp}
R417 N115 N163 {Rsh}
R418 N115 N083 {Rs}
I210 N084 N165 {Iph}
D419 N165 N084 diffusion
D420 N165 N084 recombination
C210 N165 N084 {Cp}
R419 N165 N084 {Rsh}
R420 N165 N164 {Rs}
I211 N087 N168 {Iph}
D421 N168 N087 diffusion
D422 N168 N087 recombination
C211 N168 N087 {Cp}
R421 N168 N087 {Rsh}
R422 N168 N167 {Rs}
I212 N166 N116 {Iph}
D423 N116 N166 diffusion
D424 N116 N166 recombination
C212 N116 N166 {Cp}
R423 N116 N166 {Rsh}
R424 N116 N086 {Rs}
I213 N083 N029 {Iph}
D425 N029 N083 diffusion
D426 N029 N083 recombination
C213 N029 N083 {Cp}
R425 N029 N083 {Rsh}
R426 N029 N030 {Rs}
I214 N030 N085 {Iph}
D427 N085 N030 diffusion
D428 N085 N030 recombination
C214 N085 N030 {Cp}
R427 N085 N030 {Rsh}
R428 N085 N084 {Rs}
I215 N032 N088 {Iph}
D429 N088 N032 diffusion
D430 N088 N032 recombination
C215 N088 N032 {Cp}
R429 N088 N032 {Rsh}
R430 N088 N087 {Rs}
I216 N086 N031 {Iph}
D431 N031 N086 diffusion
D432 N031 N086 recombination
C216 N031 N086 {Cp}
R431 N031 N086 {Rsh}
R432 N031 N032 {Rs}
I217 N1424 N1393 {Iph}
D433 N1393 N1424 diffusion
D434 N1393 N1424 recombination
C218 N1393 N1424 {Cp}
R434 N1393 N1424 {Rsh}
R435 N1393 N1357 {Rs}
I218 N1358 N1427 {Iph}
D435 N1427 N1358 diffusion
D436 N1427 N1358 recombination
C219 N1427 N1358 {Cp}
R436 N1427 N1358 {Rsh}
R437 N1427 N1426 {Rs}
I219 N1361 N1429 {Iph}
D437 N1429 N1361 diffusion
D438 N1429 N1361 recombination
C220 N1429 N1361 {Cp}
R438 N1429 N1361 {Rsh}
R439 N1429 N1428 {Rs}
I220 N1426 N1394 {Ifail}
D439 N1394 N1426 diffusion
D440 N1394 N1426 recombination
C221 N1394 N1426 {Cp}
R440 N1394 N1426 {Rsh}
R441 N1394 N1360 {Rs}
I221 N1357 N1313 {Iph}
D441 N1313 N1357 diffusion
D442 N1313 N1357 recombination
C222 N1313 N1357 {Cp}
R442 N1313 N1357 {Rsh}
R443 N1313 N1277 {Rs}
I222 N1278 N1359 {Iph}
D443 N1359 N1278 diffusion
D444 N1359 N1278 recombination
C223 N1359 N1278 {Cp}
R444 N1359 N1278 {Rsh}
R445 N1359 N1358 {Rs}
I223 N1281 N1362 {Iph}
D445 N1362 N1281 diffusion
D446 N1362 N1281 recombination
C224 N1362 N1281 {Cp}
R446 N1362 N1281 {Rsh}
R447 N1362 N1361 {Rs}
I224 N1360 N1314 {Iph}
D447 N1314 N1360 diffusion
D448 N1314 N1360 recombination
C225 N1314 N1360 {Cp}
R448 N1314 N1360 {Rsh}
R449 N1314 N1280 {Rs}
I225 N1277 N1233 {Iph}
D449 N1233 N1277 diffusion
D450 N1233 N1277 recombination
C226 N1233 N1277 {Cp}
R450 N1233 N1277 {Rsh}
R451 N1233 N1197 {Rs}
I226 N1198 N1279 {Iph}
D451 N1279 N1198 diffusion
D452 N1279 N1198 recombination
C227 N1279 N1198 {Cp}
R452 N1279 N1198 {Rsh}
R453 N1279 N1278 {Rs}
I227 N1201 N1282 {Iph}
D453 N1282 N1201 diffusion
D454 N1282 N1201 recombination
C228 N1282 N1201 {Cp}
R454 N1282 N1201 {Rsh}
R455 N1282 N1281 {Rs}
I228 N1280 N1234 {Iph}
D455 N1234 N1280 diffusion
D456 N1234 N1280 recombination
C229 N1234 N1280 {Cp}
R456 N1234 N1280 {Rsh}
R457 N1234 N1200 {Rs}
I229 N1197 N1153 {Iph}
D457 N1153 N1197 diffusion
D458 N1153 N1197 recombination
C230 N1153 N1197 {Cp}
R458 N1153 N1197 {Rsh}
R459 N1153 N1117 {Rs}
I230 N1118 N1199 {Iph}
D459 N1199 N1118 diffusion
D460 N1199 N1118 recombination
C231 N1199 N1118 {Cp}
R460 N1199 N1118 {Rsh}
R461 N1199 N1198 {Rs}
I231 N1121 N1202 {Iph}
D461 N1202 N1121 diffusion
D462 N1202 N1121 recombination
C232 N1202 N1121 {Cp}
R462 N1202 N1121 {Rsh}
R463 N1202 N1201 {Rs}
I232 N1200 N1154 {Iph}
D463 N1154 N1200 diffusion
D464 N1154 N1200 recombination
C233 N1154 N1200 {Cp}
R464 N1154 N1200 {Rsh}
R465 N1154 N1120 {Rs}
I233 N1117 N1073 {Iph}
D465 N1073 N1117 diffusion
D466 N1073 N1117 recombination
C234 N1073 N1117 {Cp}
R466 N1073 N1117 {Rsh}
R467 N1073 N1037 {Rs}
I234 N1038 N1119 {Iph}
D467 N1119 N1038 diffusion
D468 N1119 N1038 recombination
C235 N1119 N1038 {Cp}
R468 N1119 N1038 {Rsh}
R469 N1119 N1118 {Rs}
I235 N1041 N1122 {Iph}
D469 N1122 N1041 diffusion
D470 N1122 N1041 recombination
C236 N1122 N1041 {Cp}
R470 N1122 N1041 {Rsh}
R471 N1122 N1121 {Rs}
I236 N1120 N1074 {Iph}
D471 N1074 N1120 diffusion
D472 N1074 N1120 recombination
C237 N1074 N1120 {Cp}
R472 N1074 N1120 {Rsh}
R473 N1074 N1040 {Rs}
I237 N1037 N993 {Iph}
D473 N993 N1037 diffusion
D474 N993 N1037 recombination
C238 N993 N1037 {Cp}
R474 N993 N1037 {Rsh}
R475 N993 N957 {Rs}
I238 N958 N1039 {Iph}
D475 N1039 N958 diffusion
D476 N1039 N958 recombination
C239 N1039 N958 {Cp}
R476 N1039 N958 {Rsh}
R477 N1039 N1038 {Rs}
I239 N961 N1042 {Iph}
D477 N1042 N961 diffusion
D478 N1042 N961 recombination
C240 N1042 N961 {Cp}
R478 N1042 N961 {Rsh}
R479 N1042 N1041 {Rs}
I240 N1040 N994 {Iph}
D479 N994 N1040 diffusion
D480 N994 N1040 recombination
C241 N994 N1040 {Cp}
R480 N994 N1040 {Rsh}
R481 N994 N960 {Rs}
I241 N957 N913 {Iph}
D481 N913 N957 diffusion
D482 N913 N957 recombination
C242 N913 N957 {Cp}
R482 N913 N957 {Rsh}
R483 N913 N877 {Rs}
I242 N878 N959 {Iph}
D483 N959 N878 diffusion
D484 N959 N878 recombination
C243 N959 N878 {Cp}
R484 N959 N878 {Rsh}
R485 N959 N958 {Rs}
I243 N881 N962 {Iph}
D485 N962 N881 diffusion
D486 N962 N881 recombination
C244 N962 N881 {Cp}
R486 N962 N881 {Rsh}
R487 N962 N961 {Rs}
I244 N960 N914 {Iph}
D487 N914 N960 diffusion
D488 N914 N960 recombination
C245 N914 N960 {Cp}
R488 N914 N960 {Rsh}
R489 N914 N880 {Rs}
I245 N877 N833 {Iph}
D489 N833 N877 diffusion
D490 N833 N877 recombination
C246 N833 N877 {Cp}
R490 N833 N877 {Rsh}
R491 N833 N797 {Rs}
I246 N798 N879 {Iph}
D491 N879 N798 diffusion
D492 N879 N798 recombination
C247 N879 N798 {Cp}
R492 N879 N798 {Rsh}
R493 N879 N878 {Rs}
I247 N801 N882 {Iph}
D493 N882 N801 diffusion
D494 N882 N801 recombination
C248 N882 N801 {Cp}
R494 N882 N801 {Rsh}
R495 N882 N881 {Rs}
I248 N880 N834 {Iph}
D495 N834 N880 diffusion
D496 N834 N880 recombination
C249 N834 N880 {Cp}
R496 N834 N880 {Rsh}
R497 N834 N800 {Rs}
I249 N797 N753 {Iph}
D497 N753 N797 diffusion
D498 N753 N797 recombination
C250 N753 N797 {Cp}
R498 N753 N797 {Rsh}
R499 N753 N717 {Rs}
I250 N718 N799 {Iph}
D499 N799 N718 diffusion
D500 N799 N718 recombination
C251 N799 N718 {Cp}
R500 N799 N718 {Rsh}
R501 N799 N798 {Rs}
I251 N721 N802 {Iph}
D501 N802 N721 diffusion
D502 N802 N721 recombination
C252 N802 N721 {Cp}
R502 N802 N721 {Rsh}
R503 N802 N801 {Rs}
I252 N800 N754 {Iph}
D503 N754 N800 diffusion
D504 N754 N800 recombination
C253 N754 N800 {Cp}
R504 N754 N800 {Rsh}
R505 N754 N720 {Rs}
I253 N717 N673 {Iph}
D505 N673 N717 diffusion
D506 N673 N717 recombination
C254 N673 N717 {Cp}
R506 N673 N717 {Rsh}
R507 N673 N637 {Rs}
I254 N638 N719 {Iph}
D507 N719 N638 diffusion
D508 N719 N638 recombination
C255 N719 N638 {Cp}
R508 N719 N638 {Rsh}
R509 N719 N718 {Rs}
I255 N641 N722 {Iph}
D509 N722 N641 diffusion
D510 N722 N641 recombination
C256 N722 N641 {Cp}
R510 N722 N641 {Rsh}
R511 N722 N721 {Rs}
I256 N720 N674 {Iph}
D511 N674 N720 diffusion
D512 N674 N720 recombination
C257 N674 N720 {Cp}
R512 N674 N720 {Rsh}
R513 N674 N640 {Rs}
I257 N637 N593 {Iph}
D513 N593 N637 diffusion
D514 N593 N637 recombination
C258 N593 N637 {Cp}
R514 N593 N637 {Rsh}
R515 N593 N557 {Rs}
I258 N558 N639 {Iph}
D515 N639 N558 diffusion
D516 N639 N558 recombination
C259 N639 N558 {Cp}
R516 N639 N558 {Rsh}
R517 N639 N638 {Rs}
I259 N561 N642 {Iph}
D517 N642 N561 diffusion
D518 N642 N561 recombination
C260 N642 N561 {Cp}
R518 N642 N561 {Rsh}
R519 N642 N641 {Rs}
I260 N640 N594 {Iph}
D519 N594 N640 diffusion
D520 N594 N640 recombination
C261 N594 N640 {Cp}
R520 N594 N640 {Rsh}
R521 N594 N560 {Rs}
I261 N557 N513 {Iph}
D521 N513 N557 diffusion
D522 N513 N557 recombination
C262 N513 N557 {Cp}
R522 N513 N557 {Rsh}
R523 N513 N477 {Rs}
I262 N478 N559 {Iph}
D523 N559 N478 diffusion
D524 N559 N478 recombination
C263 N559 N478 {Cp}
R524 N559 N478 {Rsh}
R525 N559 N558 {Rs}
I263 N481 N562 {Iph}
D525 N562 N481 diffusion
D526 N562 N481 recombination
C264 N562 N481 {Cp}
R526 N562 N481 {Rsh}
R527 N562 N561 {Rs}
I264 N560 N514 {Iph}
D527 N514 N560 diffusion
D528 N514 N560 recombination
C265 N514 N560 {Cp}
R528 N514 N560 {Rsh}
R529 N514 N480 {Rs}
I265 N477 N433 {Iph}
D529 N433 N477 diffusion
D530 N433 N477 recombination
C266 N433 N477 {Cp}
R530 N433 N477 {Rsh}
R531 N433 N397 {Rs}
I266 N398 N479 {Iph}
D531 N479 N398 diffusion
D532 N479 N398 recombination
C267 N479 N398 {Cp}
R532 N479 N398 {Rsh}
R533 N479 N478 {Rs}
I267 N401 N482 {Iph}
D533 N482 N401 diffusion
D534 N482 N401 recombination
C268 N482 N401 {Cp}
R534 N482 N401 {Rsh}
R535 N482 N481 {Rs}
I268 N480 N434 {Iph}
D535 N434 N480 diffusion
D536 N434 N480 recombination
C269 N434 N480 {Cp}
R536 N434 N480 {Rsh}
R537 N434 N400 {Rs}
I269 N397 N353 {Iph}
D537 N353 N397 diffusion
D538 N353 N397 recombination
C270 N353 N397 {Cp}
R538 N353 N397 {Rsh}
R539 N353 N317 {Rs}
I270 N318 N399 {Iph}
D539 N399 N318 diffusion
D540 N399 N318 recombination
C271 N399 N318 {Cp}
R540 N399 N318 {Rsh}
R541 N399 N398 {Rs}
I271 N321 N402 {Iph}
D541 N402 N321 diffusion
D542 N402 N321 recombination
C272 N402 N321 {Cp}
R542 N402 N321 {Rsh}
R543 N402 N401 {Rs}
I272 N400 N354 {Iph}
D543 N354 N400 diffusion
D544 N354 N400 recombination
C273 N354 N400 {Cp}
R544 N354 N400 {Rsh}
R545 N354 N320 {Rs}
I273 N317 N273 {Iph}
D545 N273 N317 diffusion
D546 N273 N317 recombination
C274 N273 N317 {Cp}
R546 N273 N317 {Rsh}
R547 N273 N237 {Rs}
I274 N238 N319 {Iph}
D547 N319 N238 diffusion
D548 N319 N238 recombination
C275 N319 N238 {Cp}
R548 N319 N238 {Rsh}
R549 N319 N318 {Rs}
I275 N241 N322 {Iph}
D549 N322 N241 diffusion
D550 N322 N241 recombination
C276 N322 N241 {Cp}
R550 N322 N241 {Rsh}
R551 N322 N321 {Rs}
I276 N320 N274 {Iph}
D551 N274 N320 diffusion
D552 N274 N320 recombination
C277 N274 N320 {Cp}
R552 N274 N320 {Rsh}
R553 N274 N240 {Rs}
I277 N237 N193 {Iph}
D553 N193 N237 diffusion
D554 N193 N237 recombination
C278 N193 N237 {Cp}
R554 N193 N237 {Rsh}
R555 N193 N157 {Rs}
I278 N158 N239 {Iph}
D555 N239 N158 diffusion
D556 N239 N158 recombination
C279 N239 N158 {Cp}
R556 N239 N158 {Rsh}
R557 N239 N238 {Rs}
I279 N161 N242 {Iph}
D557 N242 N161 diffusion
D558 N242 N161 recombination
C280 N242 N161 {Cp}
R558 N242 N161 {Rsh}
R559 N242 N241 {Rs}
I280 N240 N194 {Iph}
D559 N194 N240 diffusion
D560 N194 N240 recombination
C281 N194 N240 {Cp}
R560 N194 N240 {Rsh}
R561 N194 N160 {Rs}
I281 N157 N113 {Iph}
D561 N113 N157 diffusion
D562 N113 N157 recombination
C282 N113 N157 {Cp}
R562 N113 N157 {Rsh}
R563 N113 N077 {Rs}
I282 N078 N159 {Iph}
D563 N159 N078 diffusion
D564 N159 N078 recombination
C283 N159 N078 {Cp}
R564 N159 N078 {Rsh}
R565 N159 N158 {Rs}
I283 N081 N162 {Iph}
D565 N162 N081 diffusion
D566 N162 N081 recombination
C284 N162 N081 {Cp}
R566 N162 N081 {Rsh}
R567 N162 N161 {Rs}
I284 N160 N114 {Iph}
D567 N114 N160 diffusion
D568 N114 N160 recombination
C285 N114 N160 {Cp}
R568 N114 N160 {Rsh}
R569 N114 N080 {Rs}
I285 N077 N025 {Iph}
D569 N025 N077 diffusion
D570 N025 N077 recombination
C286 N025 N077 {Cp}
R570 N025 N077 {Rsh}
R571 N025 N026 {Rs}
I286 N026 N079 {Iph}
D571 N079 N026 diffusion
D572 N079 N026 recombination
C287 N079 N026 {Cp}
R572 N079 N026 {Rsh}
R573 N079 N078 {Rs}
I287 N028 N082 {Iph}
D573 N082 N028 diffusion
D574 N082 N028 recombination
C288 N082 N028 {Cp}
R574 N082 N028 {Rsh}
R575 N082 N081 {Rs}
I288 N080 N027 {Iph}
D575 N027 N080 diffusion
D576 N027 N080 recombination
C289 N027 N080 {Cp}
R576 N027 N080 {Rsh}
R577 N027 N028 {Rs}
I289 N1420 N1391 {Iph}
D577 N1391 N1420 diffusion
D578 N1391 N1420 recombination
C290 N1391 N1420 {Cp}
R578 N1391 N1420 {Rsh}
R579 N1391 N1351 {Rs}
I290 N1352 N1423 {Iph}
D579 N1423 N1352 diffusion
D580 N1423 N1352 recombination
C291 N1423 N1352 {Cp}
R580 N1423 N1352 {Rsh}
R581 N1423 N1422 {Rs}
I291 N1355 N1425 {Iph}
D581 N1425 N1355 diffusion
D582 N1425 N1355 recombination
C292 N1425 N1355 {Cp}
R582 N1425 N1355 {Rsh}
R583 N1425 N1424 {Rs}
I292 N1422 N1392 {Ifail}
D583 N1392 N1422 diffusion
D584 N1392 N1422 recombination
C293 N1392 N1422 {Cp}
R584 N1392 N1422 {Rsh}
R585 N1392 N1354 {Rs}
I293 N1351 N1311 {Iph}
D585 N1311 N1351 diffusion
D586 N1311 N1351 recombination
C294 N1311 N1351 {Cp}
R586 N1311 N1351 {Rsh}
R587 N1311 N1271 {Rs}
I294 N1272 N1353 {Iph}
D587 N1353 N1272 diffusion
D588 N1353 N1272 recombination
C295 N1353 N1272 {Cp}
R588 N1353 N1272 {Rsh}
R589 N1353 N1352 {Rs}
I295 N1275 N1356 {Iph}
D589 N1356 N1275 diffusion
D590 N1356 N1275 recombination
C296 N1356 N1275 {Cp}
R590 N1356 N1275 {Rsh}
R591 N1356 N1355 {Rs}
I296 N1354 N1312 {Iph}
D591 N1312 N1354 diffusion
D592 N1312 N1354 recombination
C297 N1312 N1354 {Cp}
R592 N1312 N1354 {Rsh}
R593 N1312 N1274 {Rs}
I297 N1271 N1231 {Iph}
D593 N1231 N1271 diffusion
D594 N1231 N1271 recombination
C298 N1231 N1271 {Cp}
R594 N1231 N1271 {Rsh}
R595 N1231 N1191 {Rs}
I298 N1192 N1273 {Iph}
D595 N1273 N1192 diffusion
D596 N1273 N1192 recombination
C299 N1273 N1192 {Cp}
R596 N1273 N1192 {Rsh}
R597 N1273 N1272 {Rs}
I299 N1195 N1276 {Iph}
D597 N1276 N1195 diffusion
D598 N1276 N1195 recombination
C300 N1276 N1195 {Cp}
R598 N1276 N1195 {Rsh}
R599 N1276 N1275 {Rs}
I300 N1274 N1232 {Iph}
D599 N1232 N1274 diffusion
D600 N1232 N1274 recombination
C301 N1232 N1274 {Cp}
R600 N1232 N1274 {Rsh}
R601 N1232 N1194 {Rs}
I301 N1191 N1151 {Iph}
D601 N1151 N1191 diffusion
D602 N1151 N1191 recombination
C302 N1151 N1191 {Cp}
R602 N1151 N1191 {Rsh}
R603 N1151 N1111 {Rs}
I302 N1112 N1193 {Iph}
D603 N1193 N1112 diffusion
D604 N1193 N1112 recombination
C303 N1193 N1112 {Cp}
R604 N1193 N1112 {Rsh}
R605 N1193 N1192 {Rs}
I303 N1115 N1196 {Iph}
D605 N1196 N1115 diffusion
D606 N1196 N1115 recombination
C304 N1196 N1115 {Cp}
R606 N1196 N1115 {Rsh}
R607 N1196 N1195 {Rs}
I304 N1194 N1152 {Iph}
D607 N1152 N1194 diffusion
D608 N1152 N1194 recombination
C305 N1152 N1194 {Cp}
R608 N1152 N1194 {Rsh}
R609 N1152 N1114 {Rs}
I305 N1111 N1071 {Iph}
D609 N1071 N1111 diffusion
D610 N1071 N1111 recombination
C306 N1071 N1111 {Cp}
R610 N1071 N1111 {Rsh}
R611 N1071 N1031 {Rs}
I306 N1032 N1113 {Iph}
D611 N1113 N1032 diffusion
D612 N1113 N1032 recombination
C307 N1113 N1032 {Cp}
R612 N1113 N1032 {Rsh}
R613 N1113 N1112 {Rs}
I307 N1035 N1116 {Iph}
D613 N1116 N1035 diffusion
D614 N1116 N1035 recombination
C308 N1116 N1035 {Cp}
R614 N1116 N1035 {Rsh}
R615 N1116 N1115 {Rs}
I308 N1114 N1072 {Iph}
D615 N1072 N1114 diffusion
D616 N1072 N1114 recombination
C309 N1072 N1114 {Cp}
R616 N1072 N1114 {Rsh}
R617 N1072 N1034 {Rs}
I309 N1031 N991 {Iph}
D617 N991 N1031 diffusion
D618 N991 N1031 recombination
C310 N991 N1031 {Cp}
R618 N991 N1031 {Rsh}
R619 N991 N951 {Rs}
I310 N952 N1033 {Iph}
D619 N1033 N952 diffusion
D620 N1033 N952 recombination
C311 N1033 N952 {Cp}
R620 N1033 N952 {Rsh}
R621 N1033 N1032 {Rs}
I311 N955 N1036 {Iph}
D621 N1036 N955 diffusion
D622 N1036 N955 recombination
C312 N1036 N955 {Cp}
R622 N1036 N955 {Rsh}
R623 N1036 N1035 {Rs}
I312 N1034 N992 {Iph}
D623 N992 N1034 diffusion
D624 N992 N1034 recombination
C313 N992 N1034 {Cp}
R624 N992 N1034 {Rsh}
R625 N992 N954 {Rs}
I313 N951 N911 {Iph}
D625 N911 N951 diffusion
D626 N911 N951 recombination
C314 N911 N951 {Cp}
R626 N911 N951 {Rsh}
R627 N911 N871 {Rs}
I314 N872 N953 {Iph}
D627 N953 N872 diffusion
D628 N953 N872 recombination
C315 N953 N872 {Cp}
R628 N953 N872 {Rsh}
R629 N953 N952 {Rs}
I315 N875 N956 {Iph}
D629 N956 N875 diffusion
D630 N956 N875 recombination
C316 N956 N875 {Cp}
R630 N956 N875 {Rsh}
R631 N956 N955 {Rs}
I316 N954 N912 {Iph}
D631 N912 N954 diffusion
D632 N912 N954 recombination
C317 N912 N954 {Cp}
R632 N912 N954 {Rsh}
R633 N912 N874 {Rs}
I317 N871 N831 {Iph}
D633 N831 N871 diffusion
D634 N831 N871 recombination
C318 N831 N871 {Cp}
R634 N831 N871 {Rsh}
R635 N831 N791 {Rs}
I318 N792 N873 {Iph}
D635 N873 N792 diffusion
D636 N873 N792 recombination
C319 N873 N792 {Cp}
R636 N873 N792 {Rsh}
R637 N873 N872 {Rs}
I319 N795 N876 {Iph}
D637 N876 N795 diffusion
D638 N876 N795 recombination
C320 N876 N795 {Cp}
R638 N876 N795 {Rsh}
R639 N876 N875 {Rs}
I320 N874 N832 {Iph}
D639 N832 N874 diffusion
D640 N832 N874 recombination
C321 N832 N874 {Cp}
R640 N832 N874 {Rsh}
R641 N832 N794 {Rs}
I321 N791 N751 {Iph}
D641 N751 N791 diffusion
D642 N751 N791 recombination
C322 N751 N791 {Cp}
R642 N751 N791 {Rsh}
R643 N751 N711 {Rs}
I322 N712 N793 {Iph}
D643 N793 N712 diffusion
D644 N793 N712 recombination
C323 N793 N712 {Cp}
R644 N793 N712 {Rsh}
R645 N793 N792 {Rs}
I323 N715 N796 {Iph}
D645 N796 N715 diffusion
D646 N796 N715 recombination
C324 N796 N715 {Cp}
R646 N796 N715 {Rsh}
R647 N796 N795 {Rs}
I324 N794 N752 {Iph}
D647 N752 N794 diffusion
D648 N752 N794 recombination
C325 N752 N794 {Cp}
R648 N752 N794 {Rsh}
R649 N752 N714 {Rs}
I325 N711 N671 {Iph}
D649 N671 N711 diffusion
D650 N671 N711 recombination
C326 N671 N711 {Cp}
R650 N671 N711 {Rsh}
R651 N671 N631 {Rs}
I326 N632 N713 {Iph}
D651 N713 N632 diffusion
D652 N713 N632 recombination
C327 N713 N632 {Cp}
R652 N713 N632 {Rsh}
R653 N713 N712 {Rs}
I327 N635 N716 {Iph}
D653 N716 N635 diffusion
D654 N716 N635 recombination
C328 N716 N635 {Cp}
R654 N716 N635 {Rsh}
R655 N716 N715 {Rs}
I328 N714 N672 {Iph}
D655 N672 N714 diffusion
D656 N672 N714 recombination
C329 N672 N714 {Cp}
R656 N672 N714 {Rsh}
R657 N672 N634 {Rs}
I329 N631 N591 {Iph}
D657 N591 N631 diffusion
D658 N591 N631 recombination
C330 N591 N631 {Cp}
R658 N591 N631 {Rsh}
R659 N591 N551 {Rs}
I330 N552 N633 {Iph}
D659 N633 N552 diffusion
D660 N633 N552 recombination
C331 N633 N552 {Cp}
R660 N633 N552 {Rsh}
R661 N633 N632 {Rs}
I331 N555 N636 {Iph}
D661 N636 N555 diffusion
D662 N636 N555 recombination
C332 N636 N555 {Cp}
R662 N636 N555 {Rsh}
R663 N636 N635 {Rs}
I332 N634 N592 {Iph}
D663 N592 N634 diffusion
D664 N592 N634 recombination
C333 N592 N634 {Cp}
R664 N592 N634 {Rsh}
R665 N592 N554 {Rs}
I333 N551 N511 {Iph}
D665 N511 N551 diffusion
D666 N511 N551 recombination
C334 N511 N551 {Cp}
R666 N511 N551 {Rsh}
R667 N511 N471 {Rs}
I334 N472 N553 {Iph}
D667 N553 N472 diffusion
D668 N553 N472 recombination
C335 N553 N472 {Cp}
R668 N553 N472 {Rsh}
R669 N553 N552 {Rs}
I335 N475 N556 {Iph}
D669 N556 N475 diffusion
D670 N556 N475 recombination
C336 N556 N475 {Cp}
R670 N556 N475 {Rsh}
R671 N556 N555 {Rs}
I336 N554 N512 {Iph}
D671 N512 N554 diffusion
D672 N512 N554 recombination
C337 N512 N554 {Cp}
R672 N512 N554 {Rsh}
R673 N512 N474 {Rs}
I337 N471 N431 {Iph}
D673 N431 N471 diffusion
D674 N431 N471 recombination
C338 N431 N471 {Cp}
R674 N431 N471 {Rsh}
R675 N431 N391 {Rs}
I338 N392 N473 {Iph}
D675 N473 N392 diffusion
D676 N473 N392 recombination
C339 N473 N392 {Cp}
R676 N473 N392 {Rsh}
R677 N473 N472 {Rs}
I339 N395 N476 {Iph}
D677 N476 N395 diffusion
D678 N476 N395 recombination
C340 N476 N395 {Cp}
R678 N476 N395 {Rsh}
R679 N476 N475 {Rs}
I340 N474 N432 {Iph}
D679 N432 N474 diffusion
D680 N432 N474 recombination
C341 N432 N474 {Cp}
R680 N432 N474 {Rsh}
R681 N432 N394 {Rs}
I341 N391 N351 {Iph}
D681 N351 N391 diffusion
D682 N351 N391 recombination
C342 N351 N391 {Cp}
R682 N351 N391 {Rsh}
R683 N351 N311 {Rs}
I342 N312 N393 {Iph}
D683 N393 N312 diffusion
D684 N393 N312 recombination
C343 N393 N312 {Cp}
R684 N393 N312 {Rsh}
R685 N393 N392 {Rs}
I343 N315 N396 {Iph}
D685 N396 N315 diffusion
D686 N396 N315 recombination
C344 N396 N315 {Cp}
R686 N396 N315 {Rsh}
R687 N396 N395 {Rs}
I344 N394 N352 {Iph}
D687 N352 N394 diffusion
D688 N352 N394 recombination
C345 N352 N394 {Cp}
R688 N352 N394 {Rsh}
R689 N352 N314 {Rs}
I345 N311 N271 {Iph}
D689 N271 N311 diffusion
D690 N271 N311 recombination
C346 N271 N311 {Cp}
R690 N271 N311 {Rsh}
R691 N271 N231 {Rs}
I346 N232 N313 {Iph}
D691 N313 N232 diffusion
D692 N313 N232 recombination
C347 N313 N232 {Cp}
R692 N313 N232 {Rsh}
R693 N313 N312 {Rs}
I347 N235 N316 {Iph}
D693 N316 N235 diffusion
D694 N316 N235 recombination
C348 N316 N235 {Cp}
R694 N316 N235 {Rsh}
R695 N316 N315 {Rs}
I348 N314 N272 {Iph}
D695 N272 N314 diffusion
D696 N272 N314 recombination
C349 N272 N314 {Cp}
R696 N272 N314 {Rsh}
R697 N272 N234 {Rs}
I349 N231 N191 {Iph}
D697 N191 N231 diffusion
D698 N191 N231 recombination
C350 N191 N231 {Cp}
R698 N191 N231 {Rsh}
R699 N191 N151 {Rs}
I350 N152 N233 {Iph}
D699 N233 N152 diffusion
D700 N233 N152 recombination
C351 N233 N152 {Cp}
R700 N233 N152 {Rsh}
R701 N233 N232 {Rs}
I351 N155 N236 {Iph}
D701 N236 N155 diffusion
D702 N236 N155 recombination